# EasyEDA Pro project RCKid.epro, schematic Devboard, sheets 1 to 4 of 7

## Sheets
1 Power: Board Name: Devboard; Create Date: 2025-03-12; Page Name: Power; Project Name: rckid; Schematic Name: Devboard; Update Date: 2025-04-01; Company: EasyEDA.com; Drawed: EasyEDAPro; Page Size: A4; Part Number: JLCPCB-002; Reviewed: EasyEDAPro; Version: V0.1
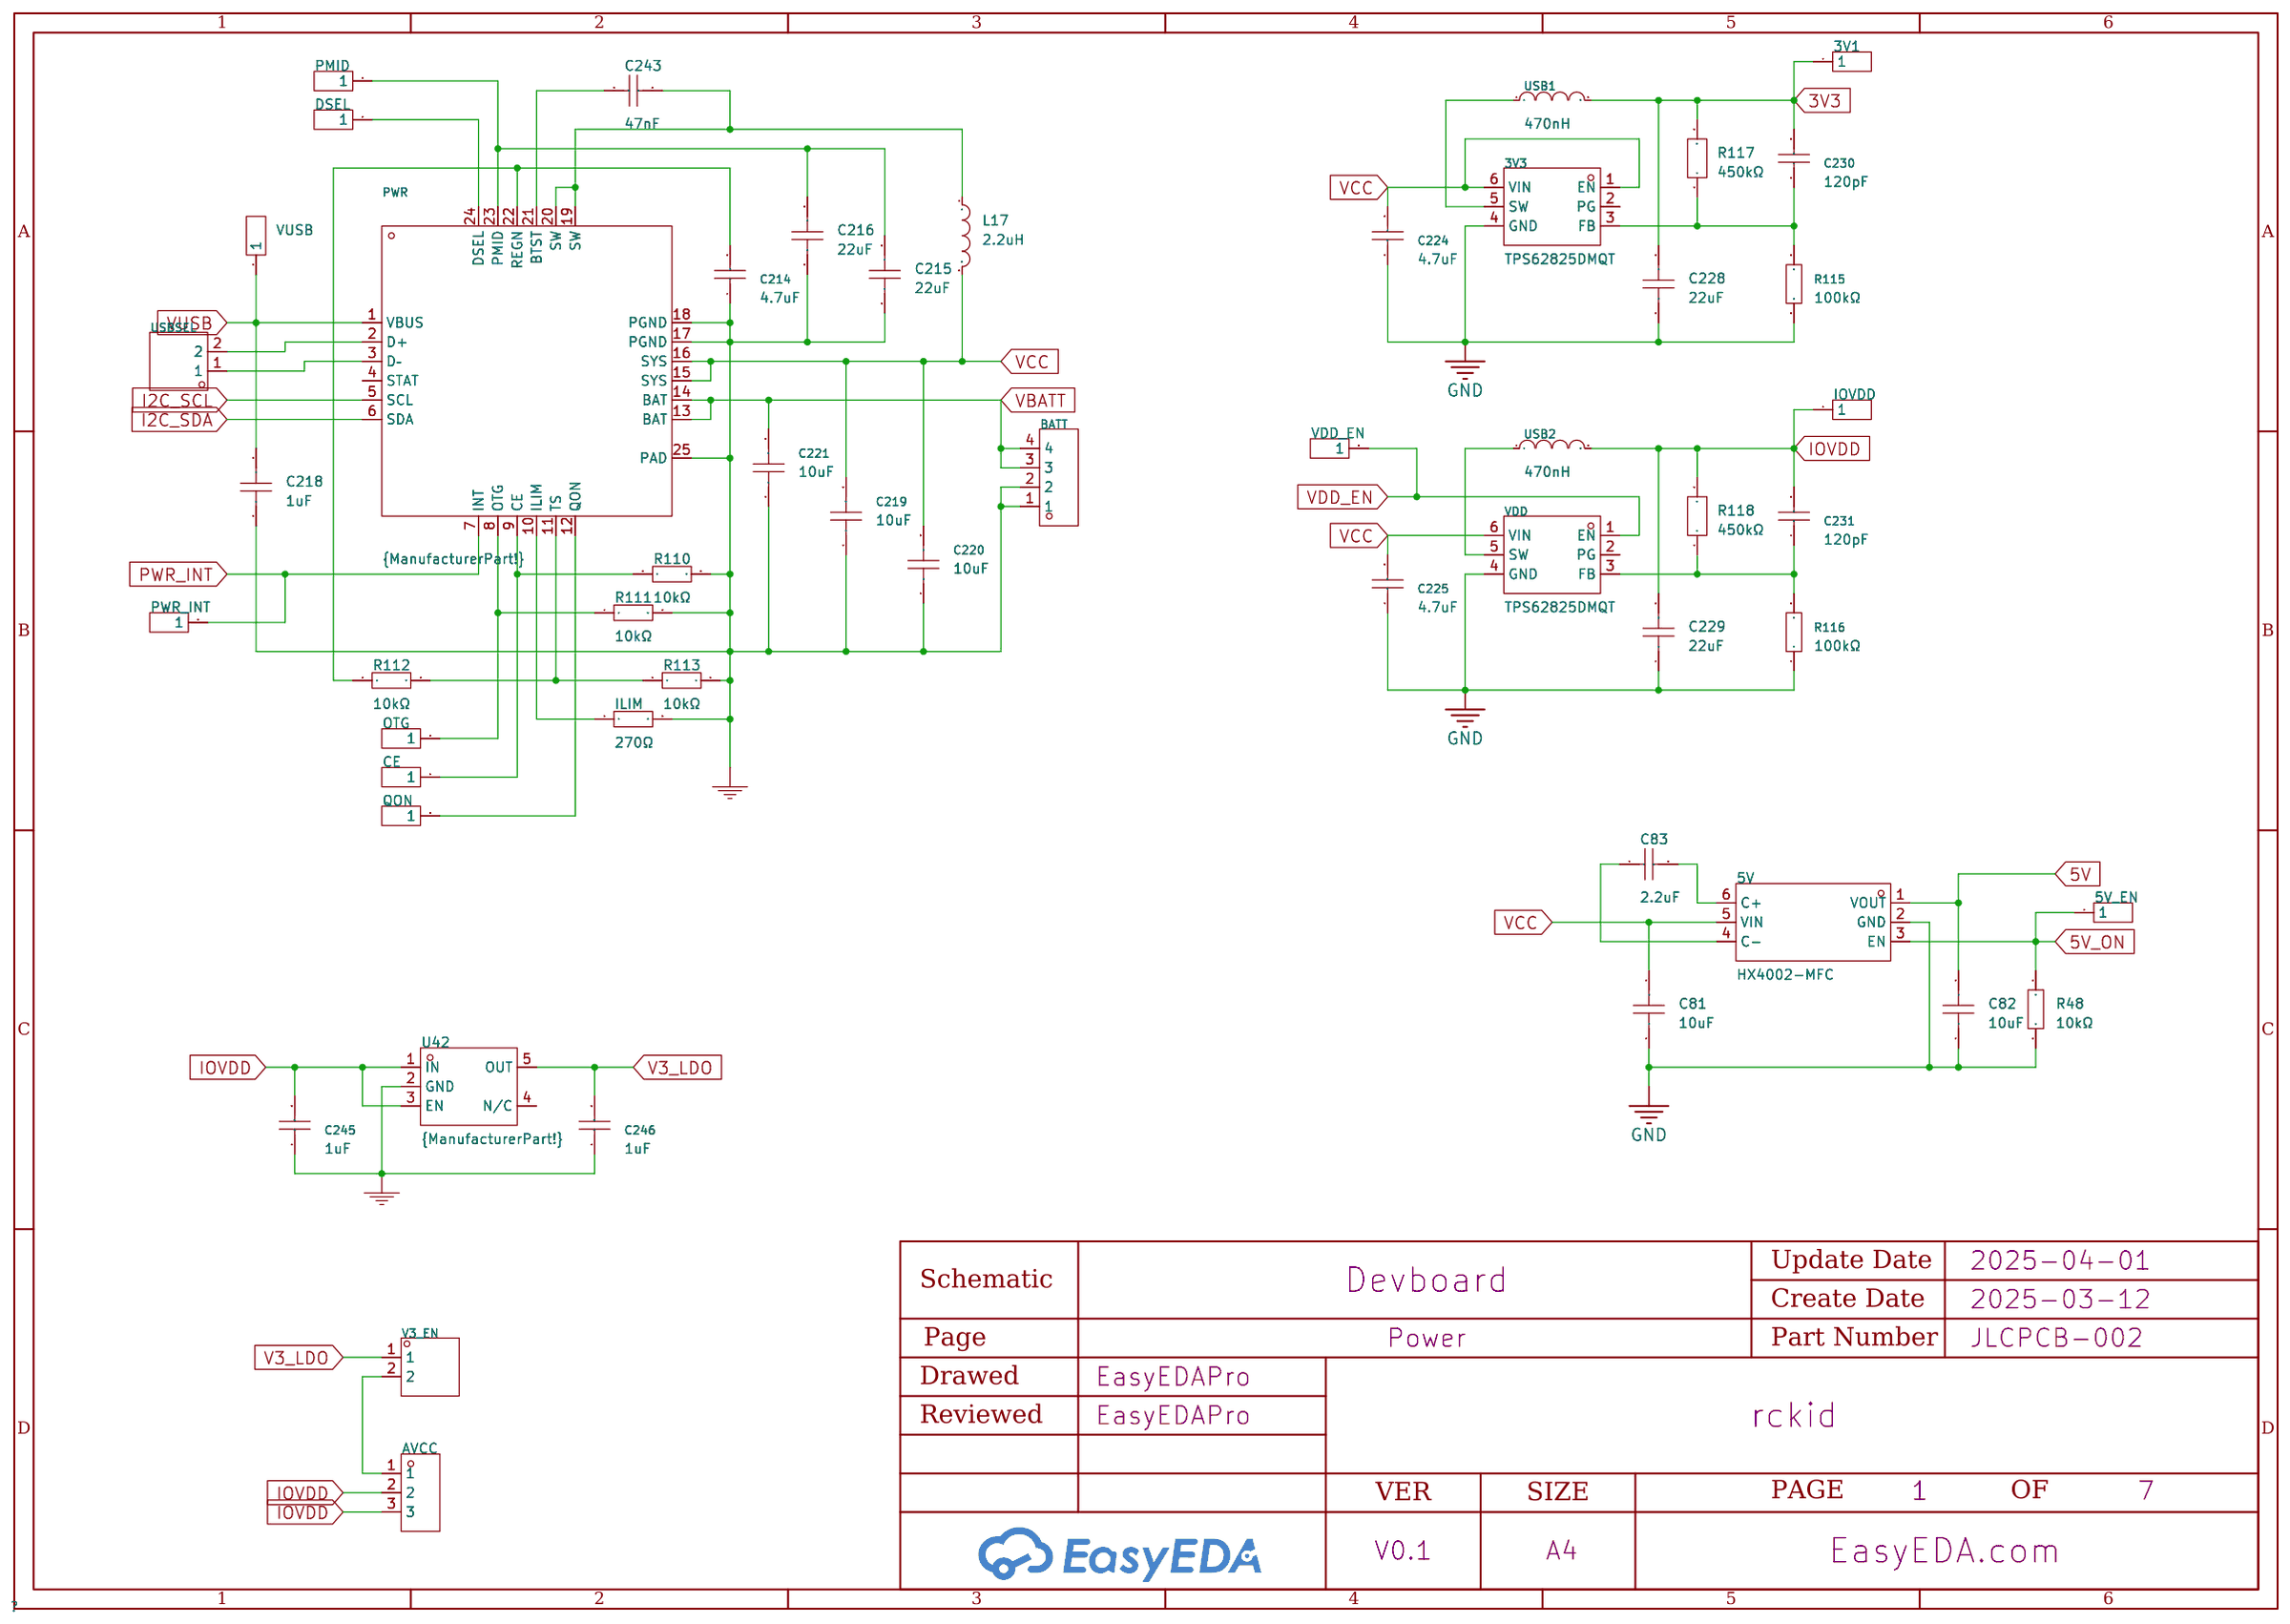
[diagram p2: Power]
2 Logic: Create Date: 2025-02-21; Page Name: Logic; Project Name: rckid3_devboard; Update Date: 2025-03-10
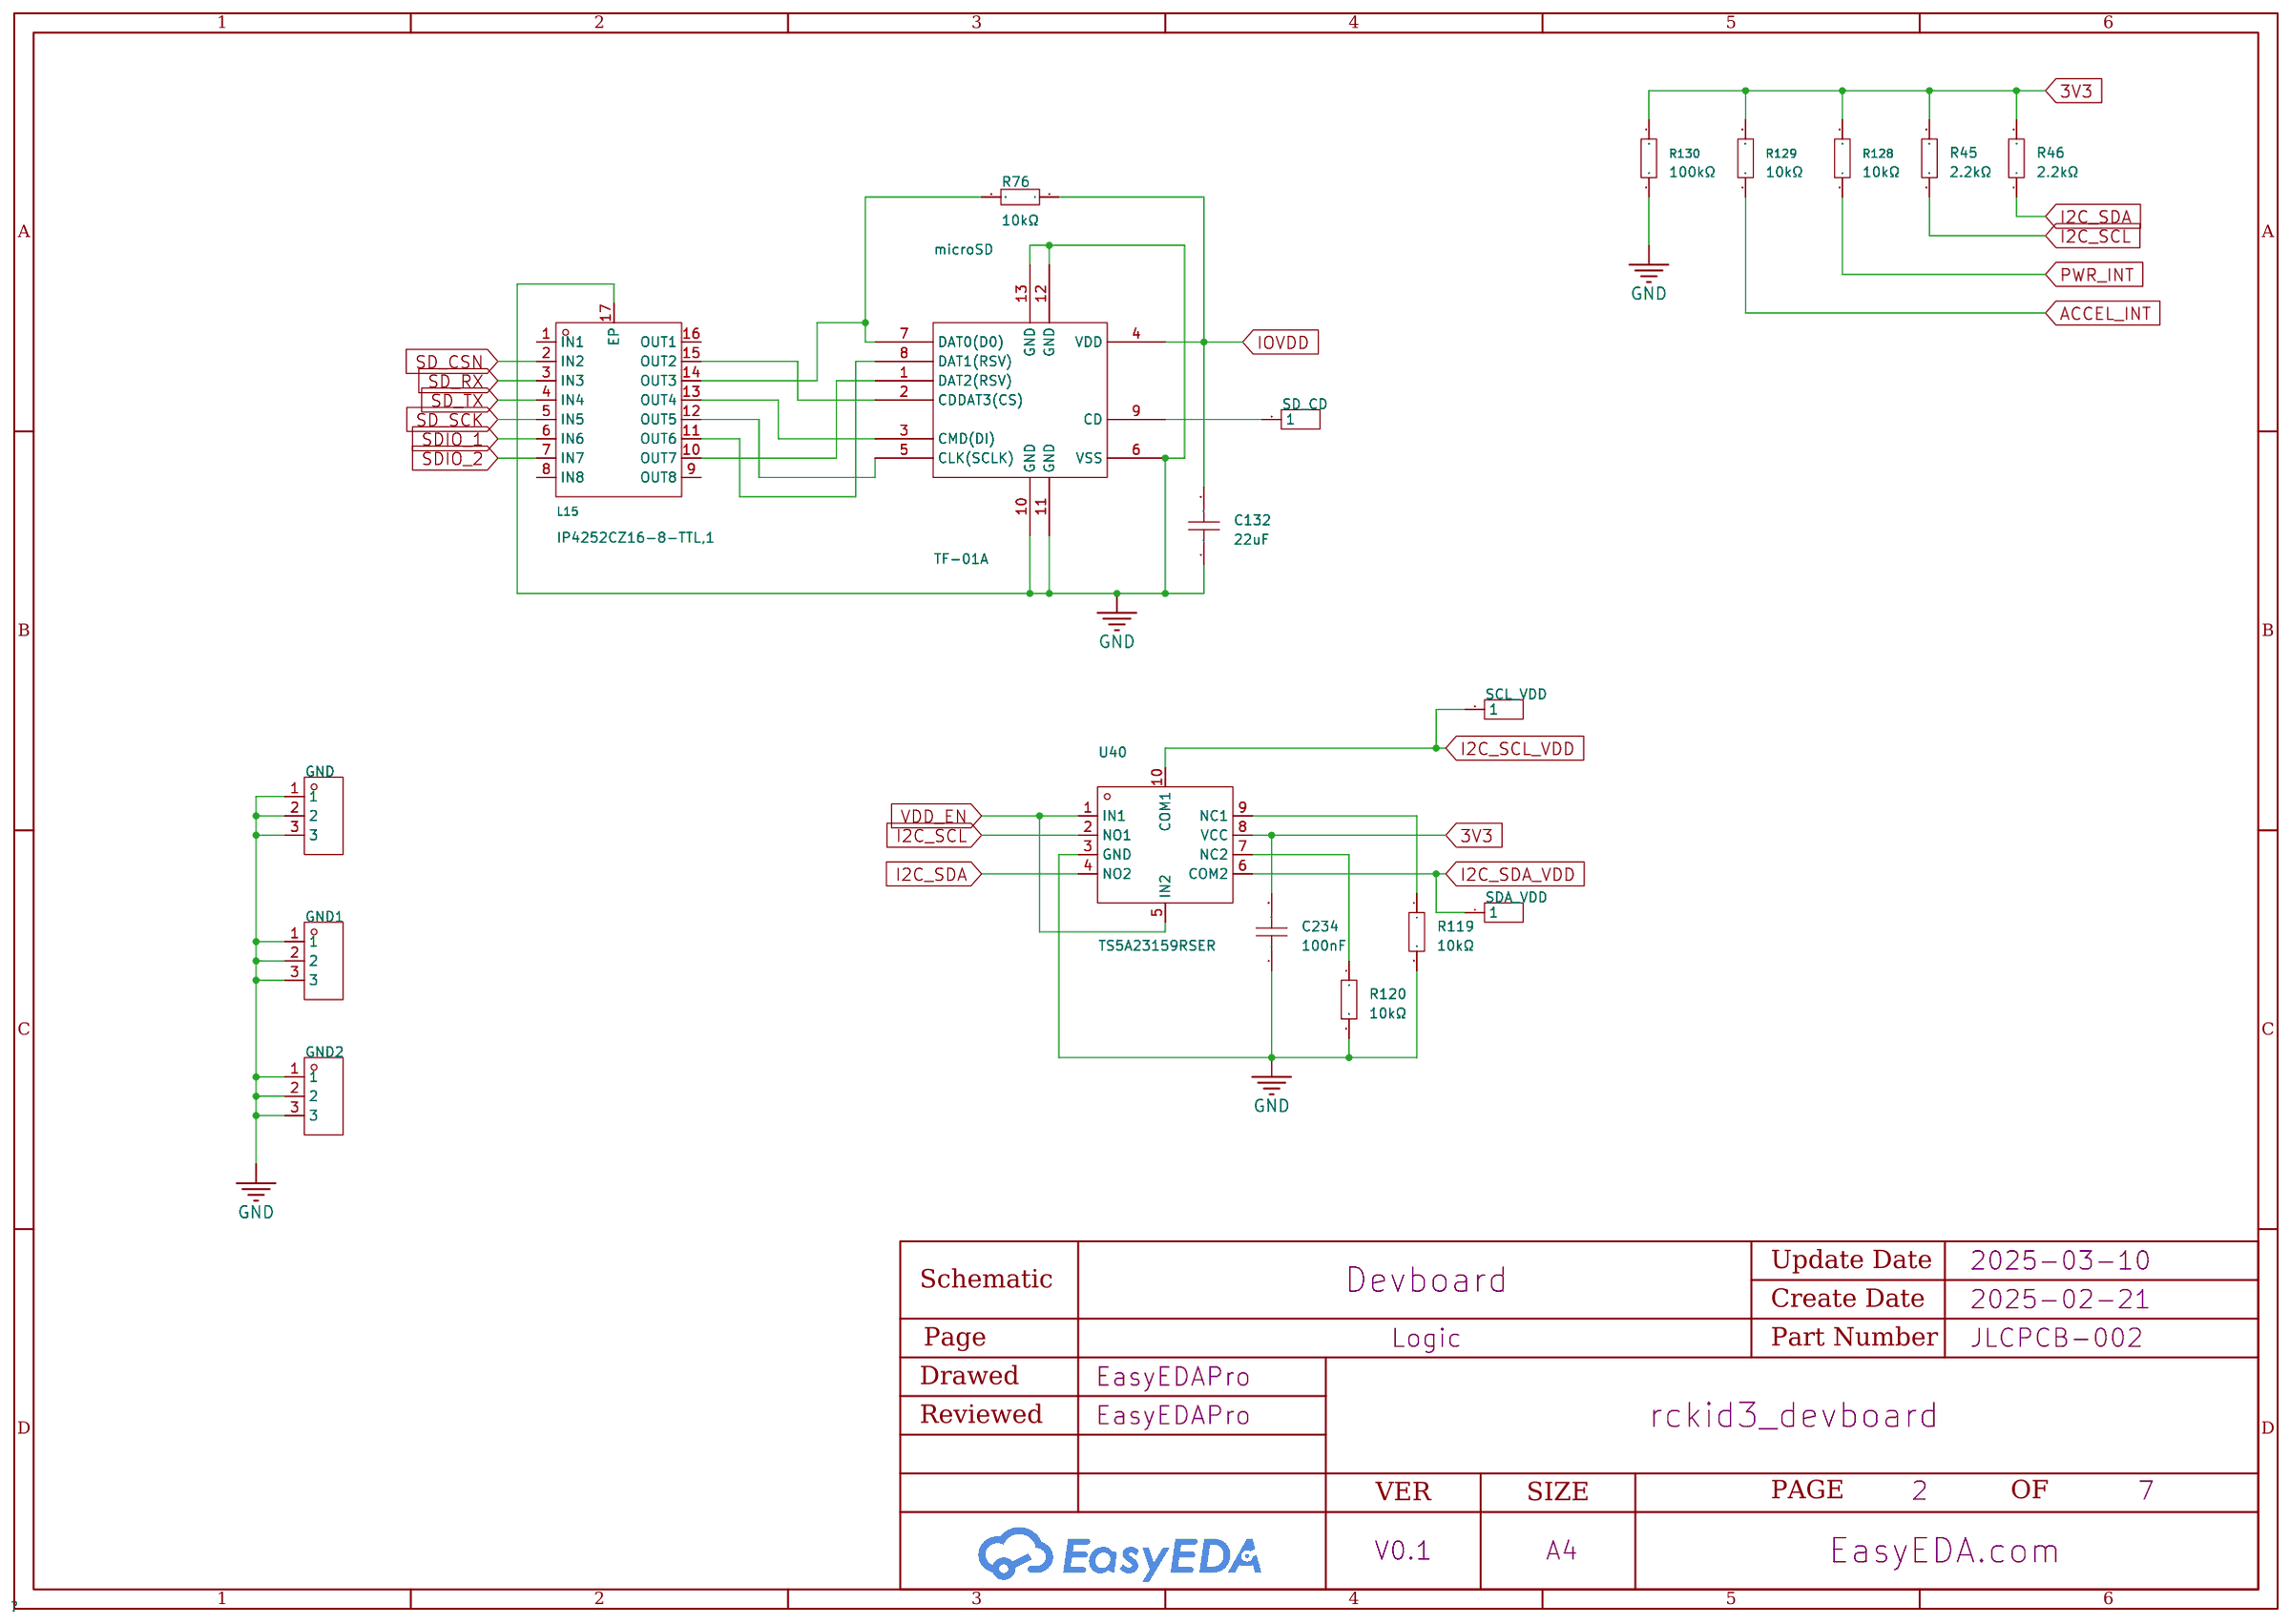
[diagram p3: Logic]
3 Audio: Page Name: Audio; Update Date: 2025-04-02
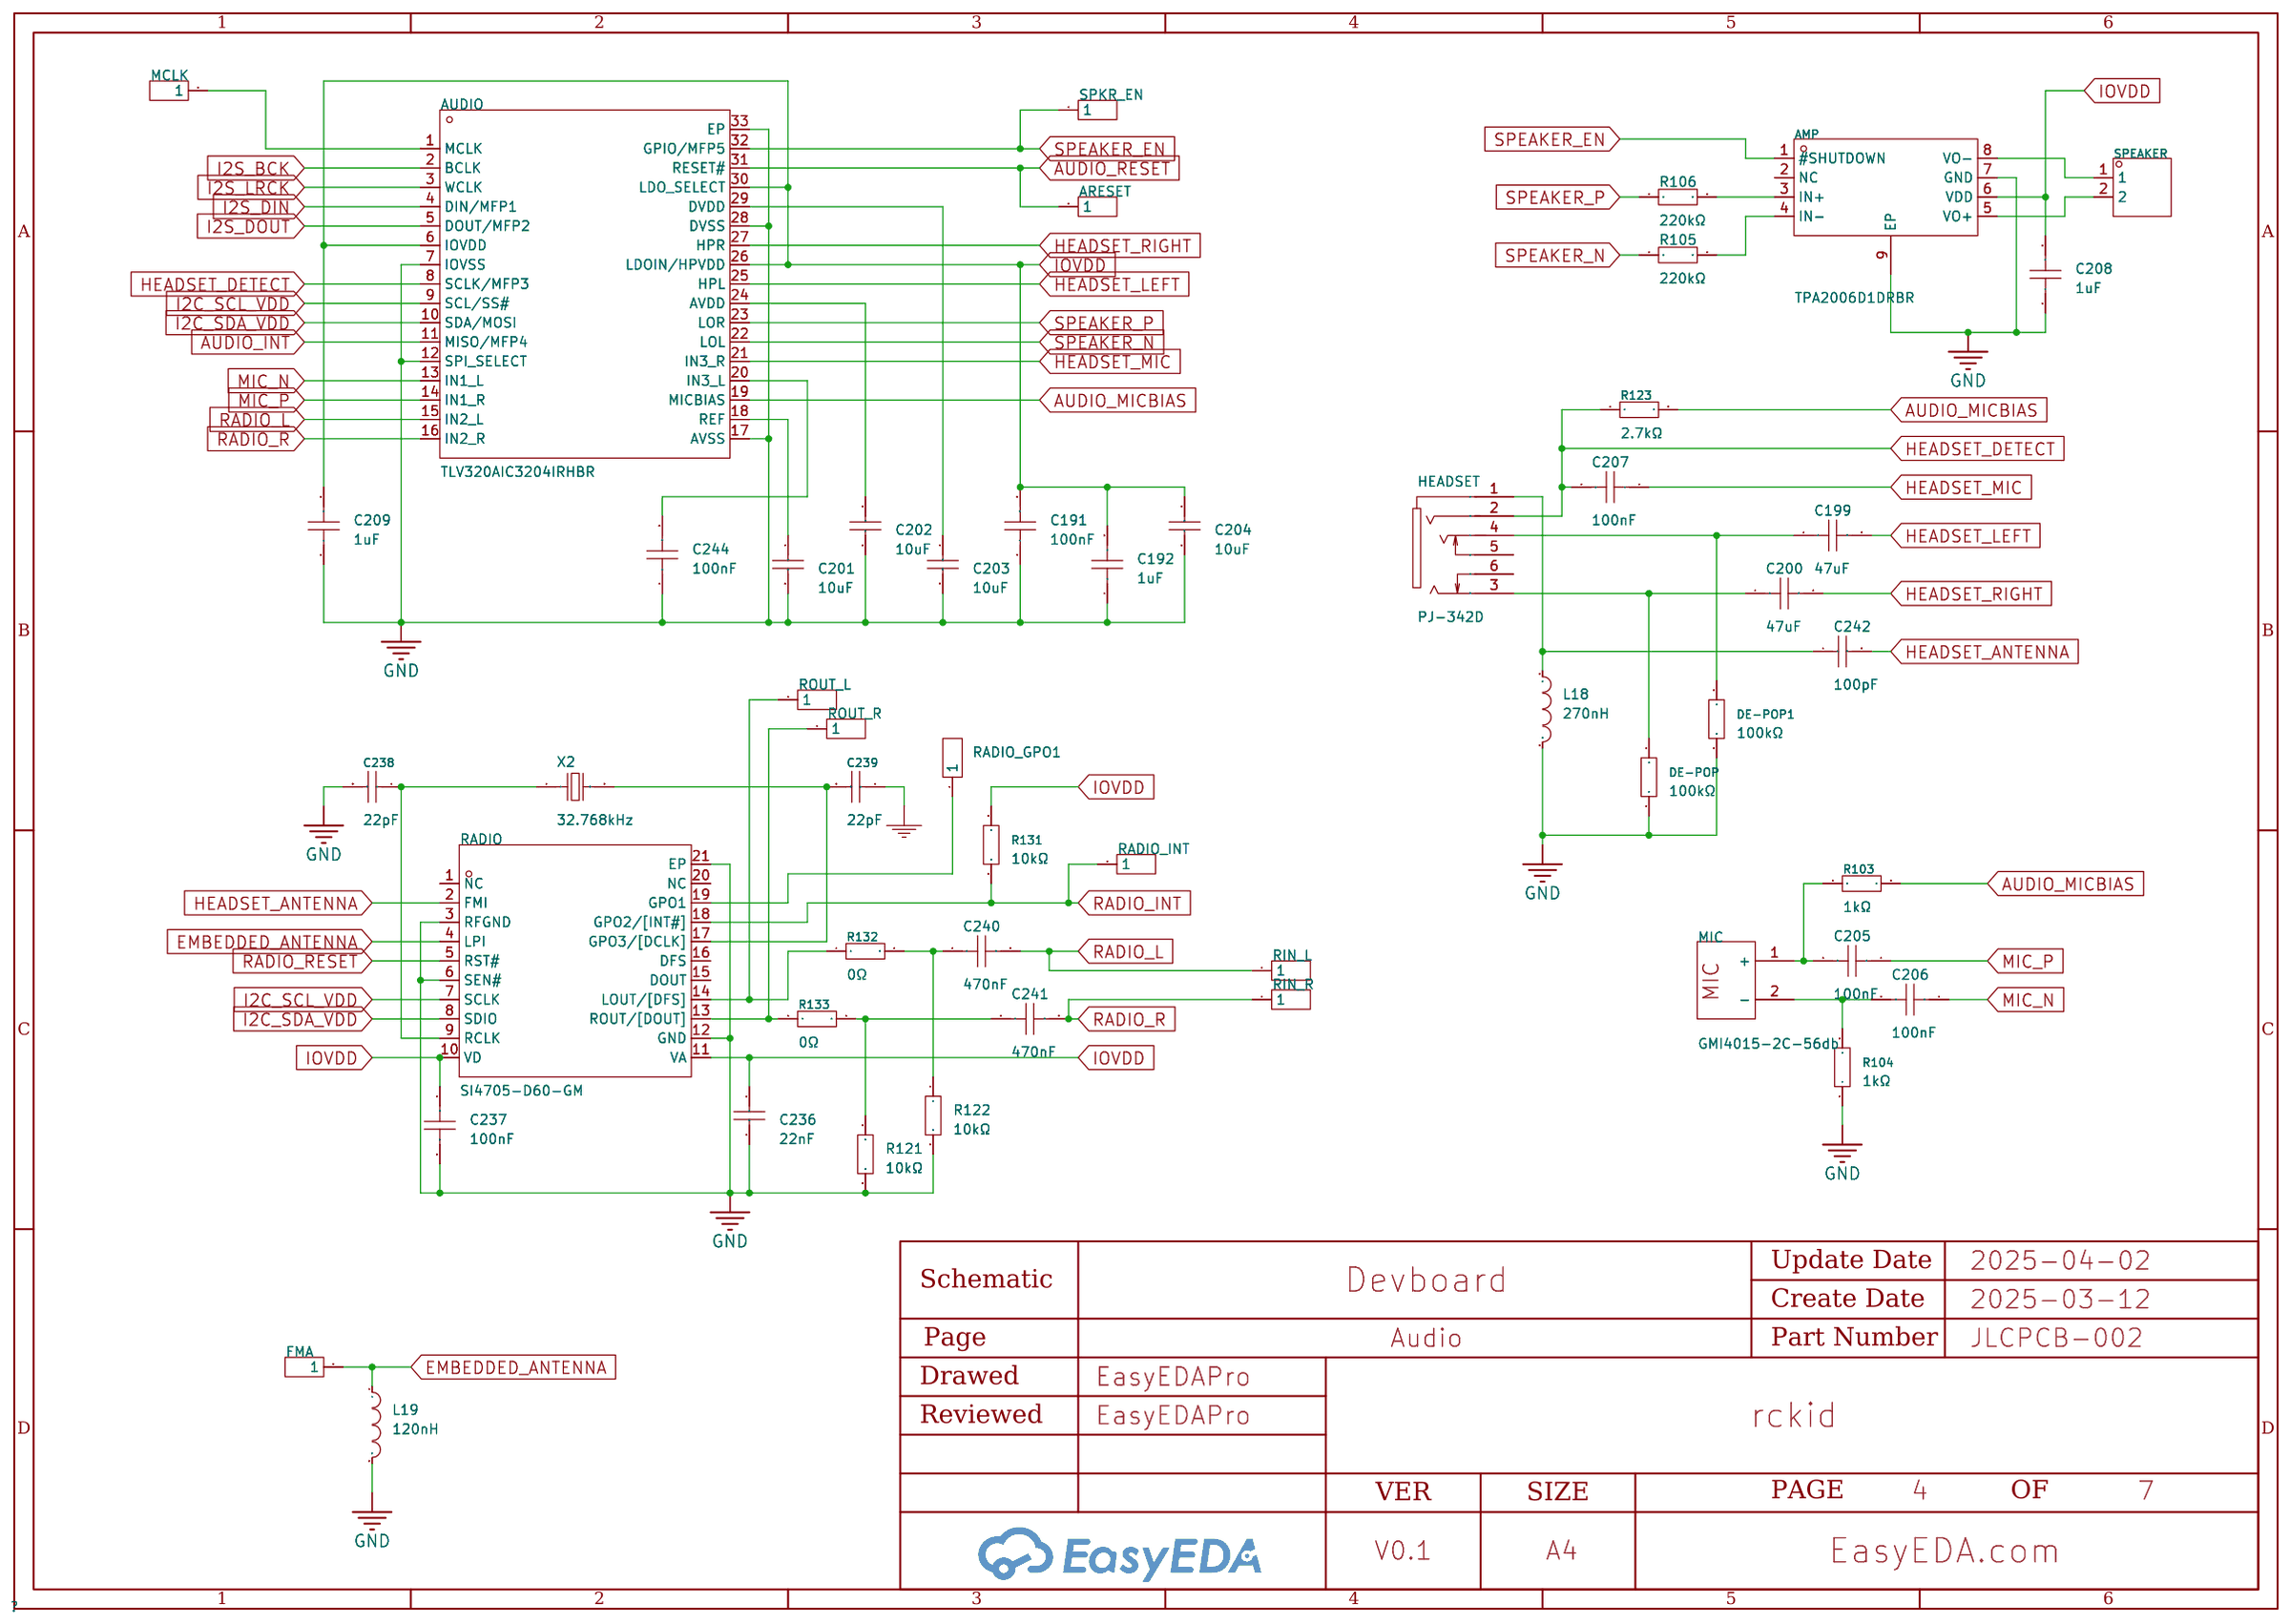
[diagram p4: Audio]
4 IO: Create Date: 2025-02-21; Page Name: IO; Project Name: rckid3_devboard; Update Date: 2025-03-10
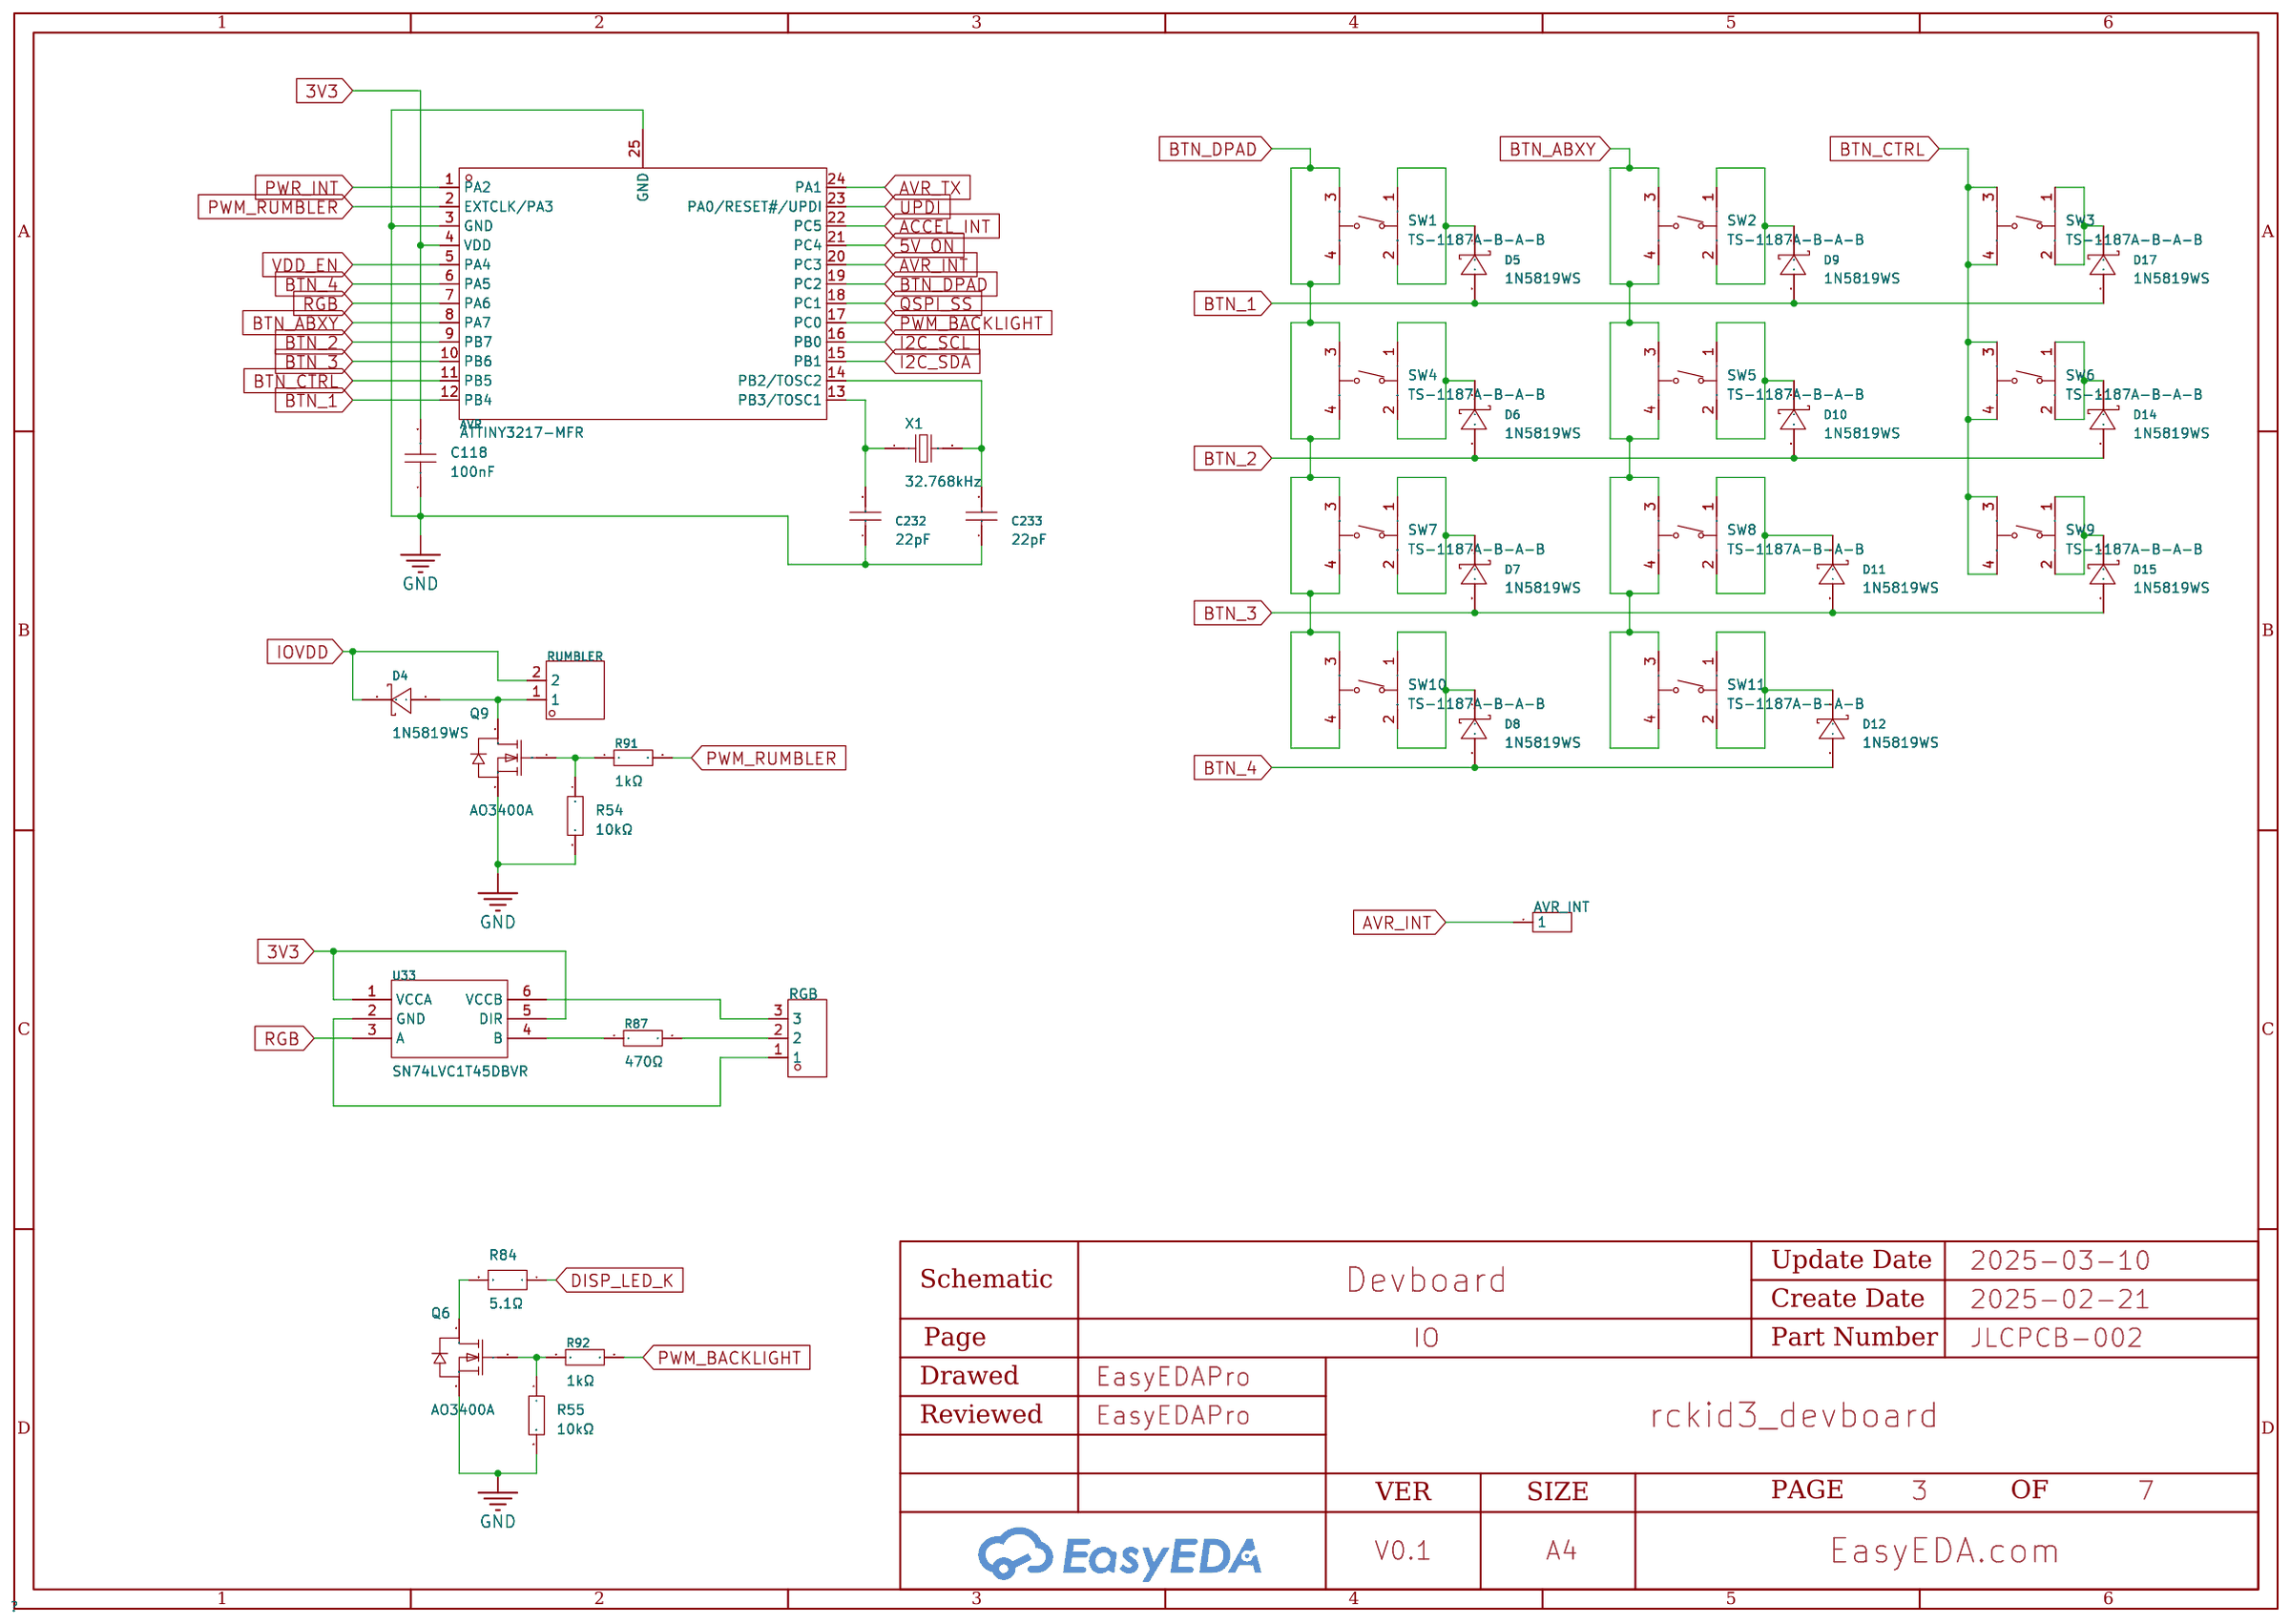
[diagram p5: IO]

## Parts
sheet Audio
AMP  TPA2006D1DRBR  [VSON-8_L3.0-W3.0-P0.65-TL-EP]
ARESET  -  [HDR-TH_1P-V-M_XKB_X4611WV-01I-C28D40]
AUDIO  TLV320AIC3204IRHBR  [QFN-32_L5.0-W5.0-P0.50-TL-EP3.4]
C191  100nF  [C0402]
C192  1uF  [C0402]
C199  47uF  [C1206]
C200  47uF  [C1206]
C201  10uF  [C0402]
C202  10uF  [C0402]
C203  10uF  [C0402]
C204  10uF  [C0402]
C205  100nF  [C0402]
C206  100nF  [C0402]
C207  100nF  [C0402]
C208  1uF  [C0402]
C209  1uF  [C0402]
C236  22nF  [C0402]
C237  100nF  [C0402]
C238  22pF  [C0805]
C239  22pF  [C0805]
C240  470nF  [C0805]
C241  470nF  [C0805]
C242  100pF  [C0402]
C244  100nF  [C0402]
DE-POP  100kΩ  [R0805]  (no BOM)
DE-POP1  100kΩ  [R0805]  (no BOM)
FMA  -  [HDR-TH_1P-V-M_XKB_X4611WV-01I-C28D40]
HEADSET  PJ-342D  [AUDIO-SMD_PJ-342D]
L18  270nH  [L0805]
L19  120nH  [L0805]
MCLK  -  [HDR-TH_1P-V-M_XKB_X4611WV-01I-C28D40]
MIC  GMI4015-2C-56db  [MIC-SMD_BD4.0_GMI4015-2C-32DB]
R103  1kΩ  [R0805]
R104  1kΩ  [R0805]
R105  220kΩ  [R0805]
R106  220kΩ  [R0805]
R121  10kΩ  [R0805]
R122  10kΩ  [R0805]
R123  2.7kΩ  [R0805]
R131  10kΩ  [R0805]  (no BOM)
R132  0Ω  [R0805]
R133  0Ω  [R0805]
RADIO  SI4705-D60-GM  [QFN-20_L3.0-W3.0-P0.50-TL-EP1.7_SILICON-LABS_SI47XX]
RADIO_GPO1  -  [HDR-TH_1P-V-M_XKB_X4611WV-01I-C28D40]
RADIO_INT  -  [HDR-TH_1P-V-M_XKB_X4611WV-01I-C28D40]
RIN_L  -  [HDR-TH_1P-V-M_XKB_X4611WV-01I-C28D40]
RIN_R  -  [HDR-TH_1P-V-M_XKB_X4611WV-01I-C28D40]
ROUT_L  -  [HDR-TH_1P-V-M_XKB_X4611WV-01I-C28D40]
ROUT_R  -  [HDR-TH_1P-V-M_XKB_X4611WV-01I-C28D40]
SPEAKER  -  [HDR-TH_2P-P2.54-V-M-1]
SPKR_EN  -  [HDR-TH_1P-V-M_XKB_X4611WV-01I-C28D40]
X2  32.768kHz  [FC-135R_L3.2-W1.5]
sheet IO
AVR  ATTINY3217-MFR  [WQFN-24_L4.0-W4.0-P0.50-TL-EP2.6]
AVR_INT  -  [HDR-TH_1P-V-M_XKB_X4611WV-01I-C28D40]
C118  100nF  [C0402]
C232  22pF  [C0805]
C233  22pF  [C0805]
D4  1N5819WS  [SOD-323_L1.8-W1.3-LS2.5-RD]
D5  1N5819WS  [SOD-323_L1.8-W1.3-LS2.5-RD]
D6  1N5819WS  [SOD-323_L1.8-W1.3-LS2.5-RD]
D7  1N5819WS  [SOD-323_L1.8-W1.3-LS2.5-RD]
D8  1N5819WS  [SOD-323_L1.8-W1.3-LS2.5-RD]
D9  1N5819WS  [SOD-323_L1.8-W1.3-LS2.5-RD]
D10  1N5819WS  [SOD-323_L1.8-W1.3-LS2.5-RD]
D11  1N5819WS  [SOD-323_L1.8-W1.3-LS2.5-RD]
D12  1N5819WS  [SOD-323_L1.8-W1.3-LS2.5-RD]
D14  1N5819WS  [SOD-323_L1.8-W1.3-LS2.5-RD]
D15  1N5819WS  [SOD-323_L1.8-W1.3-LS2.5-RD]
D17  1N5819WS  [SOD-323_L1.8-W1.3-LS2.5-RD]
Q6  AO3400A  [SOT-23-3_L2.9-W1.6-P1.90-LS2.8-BR]
Q9  AO3400A  [SOT-23-3_L2.9-W1.6-P1.90-LS2.8-BR]
R54  10kΩ  [R0402]
R55  10kΩ  [R0402]
R84  5.1Ω  [R0805]
R87  470Ω  [R0402]
R91  1kΩ  [R0402]
R92  1kΩ  [R0402]
RGB  -  [HDR-TH_3P-P2.54-V-M]
RUMBLER  -  [SMT wire pad (2)]
SW1  TS-1187A-B-A-B  [SW-SMD_4P-L5.1-W5.1-P3.70-LS6.5-TL_H1.5]
SW2  TS-1187A-B-A-B  [SW-SMD_4P-L5.1-W5.1-P3.70-LS6.5-TL_H1.5]
SW3  TS-1187A-B-A-B  [SW-SMD_4P-L5.1-W5.1-P3.70-LS6.5-TL_H1.5]
SW4  TS-1187A-B-A-B  [SW-SMD_4P-L5.1-W5.1-P3.70-LS6.5-TL_H1.5]
SW5  TS-1187A-B-A-B  [SW-SMD_4P-L5.1-W5.1-P3.70-LS6.5-TL_H1.5]
SW6  TS-1187A-B-A-B  [SW-SMD_4P-L5.1-W5.1-P3.70-LS6.5-TL_H1.5]
SW7  TS-1187A-B-A-B  [SW-SMD_4P-L5.1-W5.1-P3.70-LS6.5-TL_H1.5]
SW8  TS-1187A-B-A-B  [SW-SMD_4P-L5.1-W5.1-P3.70-LS6.5-TL_H1.5]
SW9  TS-1187A-B-A-B  [SW-SMD_4P-L5.1-W5.1-P3.70-LS6.5-TL_H1.5]
SW10  TS-1187A-B-A-B  [SW-SMD_4P-L5.1-W5.1-P3.70-LS6.5-TL_H1.5]
SW11  TS-1187A-B-A-B  [SW-SMD_4P-L5.1-W5.1-P3.70-LS6.5-TL_H1.5]
U33  SN74LVC1T45DBVR  [SOT-23-6_L2.9-W1.6-P0.95-LS2.8-BR]
X1  32.768kHz  [FC-135R_L3.2-W1.5]
sheet Logic
C132  22uF  [C0603]
C234  100nF  [C0402]
GND  -  [HDR-TH_3P-P2.54-V-M]
GND1  -  [HDR-TH_3P-P2.54-V-M]
GND2  -  [HDR-TH_3P-P2.54-V-M]
L15  IP4252CZ16-8-TTL,1  [UDFN-16_L3.3-W1.4-P0.40-BL-EP]
microSD  TF-01A  [TF-SMD_TF-01A]
R45  2.2kΩ  [R0805]
R46  2.2kΩ  [R0805]
R76  10kΩ  [R0402]
R119  10kΩ  [R0402]
R120  10kΩ  [R0402]
R128  10kΩ  [R0805]  (no BOM)
R129  10kΩ  [R0805]  (no BOM)
R130  100kΩ  [R0805]  (no BOM)
SCL_VDD  -  [HDR-TH_1P-V-M_XKB_X4611WV-01I-C28D40]
SD_CD  -  [HDR-TH_1P-V-M_XKB_X4611WV-01I-C28D40]
SDA_VDD  -  [HDR-TH_1P-V-M_XKB_X4611WV-01I-C28D40]
U40  TS5A23159RSER  [UQFN-10_L2.0-W1.5-P0.50-BL-EP]
sheet Power
3V1  -  [HDR-TH_1P-V-M_XKB_X4611WV-01I-C28D40]
3V3  TPS62825DMQT  [VSON-6_L1.5-W1.5-P0.50-TL]
5V  HX4002-MFC  [SOT-23-6_L2.9-W1.6-P0.95-LS2.8-BR]
5V_EN  -  [HDR-TH_1P-V-M_XKB_X4611WV-01I-C28D40]
AVCC  -  [HDR-TH_3P-P2.54-V-M]
BATT  -  [HDR-TH_4P-P2.54-V-M]
C81  10uF  [C0603]
C82  10uF  [C0603]
C83  2.2uF  [C0603]
C214  4.7uF  [C0402]
C215  22uF  [C0603]
C216  22uF  [C0603]
C218  1uF  [C0402]
C219  10uF  [C0603]
C220  10uF  [C0603]
C221  10uF  [C0603]
C224  4.7uF  [C0402]
C225  4.7uF  [C0402]
C228  22uF  [C0603]
C229  22uF  [C0603]
C230  120pF  [C0402]
C231  120pF  [C0402]
C243  47nF  [C0603]
C245  1uF  [C0805]
C246  1uF  [C0805]
CE  -  [HDR-TH_1P-V-M_XKB_X4611WV-01I-C28D40]
DSEL  -  [HDR-TH_1P-V-M_XKB_X4611WV-01I-C28D40]
ILIM  270Ω  [R0805]
IOVDD  -  [HDR-TH_1P-V-M_XKB_X4611WV-01I-C28D40]
L17  2.2uH  [IND-SMD_L3.0-W3.0_IHLP-1212BZ]
OTG  -  [HDR-TH_1P-V-M_XKB_X4611WV-01I-C28D40]
PMID  -  [HDR-TH_1P-V-M_XKB_X4611WV-01I-C28D40]
PWR  -  [QFN-24_L4.0-W4.0-P0.50-TL-EP2.7]
PWR_INT  -  [HDR-TH_1P-V-M_XKB_X4611WV-01I-C28D40]
QON  -  [HDR-TH_1P-V-M_XKB_X4611WV-01I-C28D40]
R48  10kΩ  [R0402]
R110  10kΩ  [R0402]
R111  10kΩ  [R0402]
R112  10kΩ  [R0402]
R113  10kΩ  [R0402]
R115  100kΩ  [R0402]
R116  100kΩ  [R0402]
R117  450kΩ  [R0402]
R118  450kΩ  [R0402]
U42  -  [TSOT-23-5_L2.9-W1.6-P0.95-LS2.8-BR]
USB1  470nH  [IND-SMD_L2.0-W1.6]
USB2  470nH  [IND-SMD_L2.0-W1.6]
USBSEL  -  [HDR-TH_2P-P2.54-V-M-1]
V3_EN  -  [HDR-TH_2P-P2.54-V-M-1]
VDD  TPS62825DMQT  [VSON-6_L1.5-W1.5-P0.50-TL]
VDD_EN  -  [HDR-TH_1P-V-M_XKB_X4611WV-01I-C28D40]
VUSB  -  [HDR-TH_1P-V-M_XKB_X4611WV-01I-C28D40]

## Library data of the parts
AMP = TPA2006D1DRBR: Type of Power Amplifier: Output Power:; LCSC Part Name: 2.5W单声道D类音频功率放大器; Supplier Part: C524793; Manufacturer: TI(德州仪器); Supplier Footprint: VSON-8-EP(3x3); JLCPCB Part Class: Extended Part; Datasheet: https://www.ti.com/cn/lit/gpn/tpa2006d1; Supplier: LCSC
3V1 5V_EN ARESET AVR_INT CE DSEL FMA IOVDD MCLK OTG PMID PWR_INT QON RADIO_GPO1 RADIO_INT RIN_L RIN_R ROUT_L ROUT_R SCL_VDD SD_CD SDA_VDD SPKR_EN VDD_EN VUSB = HDR-M_2.54_1x1P: Supplier Footprint: Through
AUDIO = TLV320AIC3204IRHBR: Type:Codec Interface:I2C；SPI Sampling Frequency:- Sampling Frequency:- Supply Voltage:- Supply Voltage:- Operating Temperature:-40℃~+85℃ Operating Temperature:-40℃~+85℃; LCSC Part Name: 超低功耗立体声音频编解码器; Supplier Part: C24109; Manufacturer: TI(德州仪器); Supplier Footprint: QFN-32-EP(5x5); JLCPCB Part Class: Extended Part; Datasheet: https://www.ti.com/cn/lit/gpn/tlv320aic3204; Supplier: LCSC; Type: Codec; Interface: I2C；SPI; Operating Temperature: -40℃~+85℃
C118 C191 C205-C207 C234 C237 C244 = CL05B104KB54PNC: Capacitance: Tolerance:±10% Tolerance:±10% Voltage Rated: Temperature Coefficient:; LCSC Part Name: 100nF ±10% 50V; Supplier Part: C307331; Manufacturer: SAMSUNG(三星); Supplier Footprint: 0402; JLCPCB Part Class: Basic Part; Datasheet: https://atta.szlcsc.com/upload/public/pdf/source/20181009/C307331_222F7C870FD3EA5F46F538B483443886.pdf; Supplier: LCSC; Tolerance: ±10%
C192 C208 C209 C218 = CL05A105KA5NQNC: Capacitance: Tolerance:±10% Tolerance:±10% Voltage Rated: Temperature Coefficient:; LCSC Part Name: 1uF±10%25V; Supplier Part: C52923; Manufacturer: SAMSUNG(三星); Supplier Footprint: 0402; JLCPCB Part Class: BasicPart; Datasheet: https://atta.szlcsc.com/upload/public/pdf/source/20160103/1457707735223.pdf; Supplier: LCSC; Tolerance: ±10%
C199 C200 = CL31A476MPHNNNE: Capacitance: Tolerance:±20% Tolerance:±20% Voltage Rated: Temperature Coefficient:; LCSC Part Name: 47uF ±20% 10V; Supplier Part: C96123; Manufacturer: SAMSUNG(三星); Supplier Footprint: 1206; JLCPCB Part Class: Basic Part; Datasheet: https://atta.szlcsc.com/upload/public/pdf/source/20160218/1457707763339.pdf; Supplier: LCSC; Tolerance: ±20%
C201-C204 = CL05A106MQ5NUNC: Capacitance: Tolerance:±20% Tolerance:±20% Voltage Rated: Temperature Coefficient:; LCSC Part Name: 10uF±20%6.3V; Supplier Part: C15525; Manufacturer: SAMSUNG(三星); Supplier Footprint: 0402; JLCPCB Part Class: BasicPart; Datasheet: https://atta.szlcsc.com/upload/public/pdf/source/20220823/2B02EE04F8F211D38A52DCB16EB6BEBA.pdf; Supplier: LCSC; Tolerance: ±20%
C236 = 0402B223K500NT: Capacitance:22nF Tolerance:±10% Tolerance:±10% Voltage Rated: Temperature Coefficient:; LCSC Part Name: 22nF ±10% 50V; Supplier Part: C1532; Manufacturer: FH(风华); Supplier Footprint: 0402; JLCPCB Part Class: Basic Part; Datasheet: https://atta.szlcsc.com/upload/public/pdf/source/20200305/C486355_26A10D38EF8C2A5C37091D0039909270.pdf; Supplier: LCSC; Tolerance: ±10%
C232 C233 C238 C239 = CL21C220JBANNNC: Capacitance: Tolerance:±5% Tolerance:±5% Voltage Rated: Temperature Coefficient:; LCSC Part Name: 22pF ±5% 50V; Supplier Part: C1804; Manufacturer: SAMSUNG(三星); Supplier Footprint: 0805; JLCPCB Part Class: Basic Part; Datasheet: https://atta.szlcsc.com/upload/public/pdf/source/20160218/1457707763339.pdf; Supplier: LCSC; Tolerance: ±5%
C240 C241 = CL21B474KBFNNNE: Capacitance: Tolerance:±10% Tolerance:±10% Voltage Rated: Temperature Coefficient:; LCSC Part Name: 470nF ±10% 50V; Supplier Part: C13967; Manufacturer: SAMSUNG(三星); Supplier Footprint: 0805; JLCPCB Part Class: Basic Part; Datasheet: https://atta.szlcsc.com/upload/public/pdf/source/20160218/1457707763339.pdf; Supplier: LCSC; Tolerance: ±10%
C242 = 0402CG101J500NT: Capacitance: Tolerance:±5% Tolerance:±5% Voltage Rated: Temperature Coefficient:; LCSC Part Name: 100pF ±5% 50V; Supplier Part: C1546; Manufacturer: FH(风华); Supplier Footprint: 0402; JLCPCB Part Class: Basic Part; Datasheet: https://atta.szlcsc.com/upload/public/pdf/source/20200305/C486355_26A10D38EF8C2A5C37091D0039909270.pdf; Supplier: LCSC; Tolerance: ±5%
DE-POP DE-POP1 R130 = 0805W8F1003T5E: Type:Thick Film Resistors Resistance:100kΩ Tolerance:±1% Tolerance:±1% Power(Watts): Overload Voltage (Max): Temperature Coefficient:±100ppm/℃ Temperature Coefficient:±100ppm/℃ Operating Temperature Range:-55℃~+155℃ Operating Temperature Range:-55℃~+155℃; LCSC Part Name: 100kΩ ±1% 125mW 厚膜电阻; Supplier Part: C149504; Manufacturer: UNI-ROYAL(厚声); Supplier Footprint: 0805; JLCPCB Part Class: Basic Part; Datasheet: https://atta.szlcsc.com/upload/public/pdf/source/20200306/C422600_1E6D84923E4A46A82E41ADD87F860B5C.pdf; Supplier: LCSC; Type: Thick Film Resistors; Tolerance: ±1%; Temperature Coefficient: ±100ppm/℃; Operating Temperature Range: -55℃~+155℃
HEADSET = PJ-342D: Connector Type:3.5mm耳机座 Current Rating (Max):500mA Voltage Rating (Max):30V Operating Temperature Range:-20℃~+70℃ Operating Temperature Range:-20℃~+70℃ Soldering Temperature(Max):235℃; LCSC Part Name: 3.5mm耳机座; Supplier Part: C2689707; Manufacturer: XKB Connectivity(中国星坤); Supplier Footprint: SMD; JLCPCB Part Class: Extended Part; Datasheet: https://atta.szlcsc.com/upload/public/pdf/source/20211011/5410BBAF7F4CEA04F8E2A1AE1B358EC2.pdf; Supplier: LCSC; Connector Type: 3.5mm耳机座; Current Rating (Max): 500mA; Voltage Rating (Max): 30V; Operating Temperature Range: -20℃~+70℃; Soldering Temperature(Max): 235℃
L18 = VHF201209HR27JT: Inductance:270nH Tolerance:±5% Tolerance:±5% Rated Current: Saturation Current (Isat):- DC Resistance (DCR): Q @ Freq:- Frequency - Self Resonant:- Ratings:; LCSC Part Name: 270nH ±5%; Supplier Part: C395103; Manufacturer: FH(风华); Supplier Footprint: 0805; JLCPCB Part Class: Extended Part; Datasheet: https://atta.szlcsc.com/upload/public/pdf/source/20230223/DB206AC541C71FBD79E291598E86C2F5.pdf; Supplier: LCSC; Tolerance: ±5%
L19 = VHF201209HR12JT: Inductance:120nH Tolerance:±5% Tolerance:±5% Rated Current: Saturation Current (Isat):- DC Resistance (DCR): Q @ Freq:- Frequency - Self Resonant:- Ratings:; LCSC Part Name: 120nH ±5%; Supplier Part: C46435; Manufacturer: FH(风华); Supplier Footprint: 0805; JLCPCB Part Class: Extended Part; Datasheet: https://atta.szlcsc.com/upload/public/pdf/source/20230223/DB206AC541C71FBD79E291598E86C2F5.pdf; Supplier: LCSC; Tolerance: ±5%
MIC = GMI4015-2C-56db: LCSC Part Name: 全指向双电容φ4.0*1.5mm 1.5V-10V 灵敏度-56dB 低阻抗; Supplier Part: C233280; Manufacturer: INGHAi(赢海); JLCPCB Part Class: Extended Part; Datasheet: https://atta.szlcsc.com/upload/public/pdf/source/20180613/C233285_B82B48E7113DD15BB0DB65002027213C.pdf; Supplier: LCSC
R103 R104 = 0805W8F1001T5E: Type:Thick Film Resistors Resistance:1kΩ Tolerance:±1% Tolerance:±1% Power(Watts): Overload Voltage (Max): Temperature Coefficient:±100ppm/℃ Temperature Coefficient:±100ppm/℃ Operating Temperature Range:-55℃~+155℃ Operating Temperature Range:-55℃~+155℃; LCSC Part Name: 1kΩ ±1% 125mW 厚膜电阻; Supplier Part: C17513; Manufacturer: UNI-ROYAL(厚声); Supplier Footprint: 0805; JLCPCB Part Class: Basic Part; Datasheet: https://atta.szlcsc.com/upload/public/pdf/source/20200306/C422600_1E6D84923E4A46A82E41ADD87F860B5C.pdf; Supplier: LCSC; Type: Thick Film Resistors; Tolerance: ±1%; Temperature Coefficient: ±100ppm/℃; Operating Temperature Range: -55℃~+155℃
R105 R106 = 0805W8F2203T5E: Type:Thick Film Resistors Resistance:220kΩ Tolerance:±1% Tolerance:±1% Power(Watts): Overload Voltage (Max): Temperature Coefficient:±100ppm/℃ Temperature Coefficient:±100ppm/℃ Operating Temperature Range:-55℃~+155℃ Operating Temperature Range:-55℃~+155℃; LCSC Part Name: 220kΩ ±1% 125mW 厚膜电阻; Supplier Part: C17556; Manufacturer: UNI-ROYAL(厚声); Supplier Footprint: 0805; JLCPCB Part Class: Basic Part; Datasheet: https://atta.szlcsc.com/upload/public/pdf/source/20200306/C422600_1E6D84923E4A46A82E41ADD87F860B5C.pdf; Supplier: LCSC; Type: Thick Film Resistors; Tolerance: ±1%; Temperature Coefficient: ±100ppm/℃; Operating Temperature Range: -55℃~+155℃
R121 R122 = 0805W8F1002T5E: Type:Thick Film Resistors Resistance:10kΩ Tolerance:±1% Tolerance:±1% Power(Watts): Overload Voltage (Max): Temperature Coefficient:±100ppm/℃ Temperature Coefficient:±100ppm/℃ Operating Temperature Range:-55℃~+155℃ Operating Temperature Range:-55℃~+155℃; LCSC Part Name: 10kΩ ±1% 125mW 厚膜电阻; Supplier Part: C17414; Manufacturer: UNI-ROYAL(厚声); Supplier Footprint: 0805; JLCPCB Part Class: Basic Part; Datasheet: https://atta.szlcsc.com/upload/public/pdf/source/20200306/C422600_1E6D84923E4A46A82E41ADD87F860B5C.pdf; Supplier: LCSC; Tolerance: ±1%; Temperature Coefficient: ±100ppm/℃; Type: Thick Film Resistors; Operating Temperature Range: -55℃~+155℃
R123 = 0805W8F2701T5E: Type:Thick Film Resistors Resistance:2.7kΩ Tolerance:±1% Tolerance:±1% Power(Watts): Overload Voltage (Max): Temperature Coefficient:±100ppm/℃ Temperature Coefficient:±100ppm/℃ Operating Temperature Range:-55℃~+155℃ Operating Temperature Range:-55℃~+155℃; LCSC Part Name: 2.7kΩ ±1% 125mW 厚膜电阻; Supplier Part: C17530; Manufacturer: UNI-ROYAL(厚声); Supplier Footprint: 0805; JLCPCB Part Class: Basic Part; Datasheet: https://atta.szlcsc.com/upload/public/pdf/source/20200306/C422600_1E6D84923E4A46A82E41ADD87F860B5C.pdf; Supplier: LCSC; Type: Thick Film Resistors; Tolerance: ±1%; Temperature Coefficient: ±100ppm/℃; Operating Temperature Range: -55℃~+155℃
R128 R129 R131 = 0805W8F1002T5E: Resistance:10000Ω Tolerance:±1% Tolerance:±1% Power(Watts): Overload Voltage (Max): Temperature Coefficient:±100ppm/℃ Temperature Coefficient:±100ppm/℃ Type:Thick Film Resistors Operating Temperature Range:-55℃~+155℃ Operating Temperature Range:-55℃~+155℃; LCSC Part Name: 10kΩ ±1% 125mW 厚膜电阻; Supplier Part: C17414; Manufacturer: UNI-ROYAL(厚声); Supplier Footprint: 0805; JLCPCB Part Class: Basic Part; Datasheet: https://atta.szlcsc.com/upload/public/pdf/source/20200306/C422600_1E6D84923E4A46A82E41ADD87F860B5C.pdf; Supplier: LCSC; Tolerance: ±1%; Temperature Coefficient: ±100ppm/℃; Type: Thick Film Resistors; Operating Temperature Range: -55℃~+155℃
R132 R133 = 0805W8F0000T5E_C17477: Type:Thick Film Resistors Resistance: Tolerance:±1% Tolerance:±1% Power(Watts): Overload Voltage (Max): Temperature Coefficient:±800ppm/℃ Temperature Coefficient:±800ppm/℃ Operating Temperature Range:-55℃~+155℃ Operating Temperature Range:-55℃~+155℃; LCSC Part Name: 0Ω ±1% 125mW 厚膜电阻; Supplier Part: C17477; Manufacturer: UNI-ROYAL(厚声); Manufacturer Part: 0805W8F0000T5E; Supplier Footprint: 0805; JLCPCB Part Class: Basic Part; Datasheet: https://atta.szlcsc.com/upload/public/pdf/source/20200306/C422600_1E6D84923E4A46A82E41ADD87F860B5C.pdf; Supplier: LCSC; Type: Thick Film Resistors; Tolerance: ±1%; Temperature Coefficient: ±800ppm/℃; Operating Temperature Range: -55℃~+155℃
RADIO = SI4705-D60-GM: Supplier Part: C1526114; Manufacturer: SKYWORKS/SILICON LABS(芯科); Supplier Footprint: QFN-20-EP(3x3); JLCPCB Part Class: Extended Part; Datasheet: https://atta.szlcsc.com/upload/public/pdf/source/20210603/097935DFE49676B16CAB25B24893A3FB.pdf; Supplier: LCSC
RUMBLER SPEAKER USBSEL V3_EN = HDR-M_2.54_1x2P: Supplier Footprint: Through
X1 X2 = Q13FC13500004_C32346: Crystal Type:Surface Mount Crystal Frequency: Normal temperature Frequency Tolerance:±20ppm Normal temperature Frequency Tolerance:±20ppm Load Capacitor: Equivalent Series Resistance (ESR):70kΩ Operating Temperature: Operating Temperature:; LCSC Part Name: 32.768kHz ±20ppm 12.5pF; Supplier Part: C32346; Manufacturer: EPSON(爱普生); Manufacturer Part: Q13FC13500004; Supplier Footprint: SMD3215-2P; JLCPCB Part Class: Basic Part; Datasheet: https://atta.szlcsc.com/upload/public/pdf/source/20240418/0E0FF5F0356BA3753F616001439D1416.pdf; Supplier: LCSC; Crystal Type: Surface Mount Crystal; Normal temperature Frequency Tolerance: ±20ppm; Equivalent Series Resistance (ESR): 70kΩ
AVR = ATTINY3217-MFR: Supplier Part: C617969; Manufacturer: MICROCHIP(美国微芯); Supplier Footprint: WQFN-24-EP(4x4); JLCPCB Part Class: Extended Part; Datasheet: https://atta.szlcsc.com/upload/public/pdf/source/20221017/C07D66C14B922F573E9000C75FCA8F84.pdf; Supplier: LCSC
D4-D12 D14 D15 D17 = 1N5819WS_C191023: Reverse Voltage (Vr):40V Average Rectified Current (Io):1A Forward Voltage (Vf@If):600mV@1A; LCSC Part Name: 40V1A600mV@1A; Supplier Part: C191023; Manufacturer: Hottech(合科泰); Supplier Footprint: SOD-323; JLCPCB Part Class: BasicPart; Datasheet: https://atta.szlcsc.com/upload/public/pdf/source/20220428/3CB86FD8D28D653594B4E35F9D5AEFD9.pdf; Supplier: LCSC; Reverse Voltage (Vr): 40V; Average Rectified Current (Io): 1A; Forward Voltage (Vf@If): 600mV@1A
Q6 Q9 = AO3400A_C20917: Type: Drain Source Voltage (Vdss): Continuous Drain Current (Id): Power Dissipation (Pd): Drain Source On Resistance (RDS(on)@Vgs,Id):26.5mΩ@10V,5.7A Gate Threshold Voltage (Vgs(th)@Id):1.5V@250uA; LCSC Part Name: N沟道30V5.7A; Supplier Part: C20917; Manufacturer: AOS; Supplier Footprint: SOT-23-3L; JLCPCB Part Class: BasicPart; Datasheet: https://atta.szlcsc.com/upload/public/pdf/source/20140107/1457706668533.pdf; Supplier: LCSC; Drain Source On Resistance (RDS(on)@Vgs,Id): 26.5mΩ@10V,5.7A; Gate Threshold Voltage (Vgs(th)@Id): 1.5V@250uA
R48 R54 R55 R76 R110-R113 R119 R120 = 0402WGF1002TCE: Type:Thick Film Resistors Resistance: Tolerance:±1% Tolerance:±1% Power(Watts): Temperature Coefficient:±100ppm/℃ Temperature Coefficient:±100ppm/℃ Overload Voltage (Max): Operating Temperature Range:-55℃~+155℃ Operating Temperature Range:-55℃~+155℃; LCSC Part Name: 10kΩ±1%62.5mW; Supplier Part: C25744; Manufacturer: UNI-ROYAL(厚声); Supplier Footprint: 0402; JLCPCB Part Class: BasicPart; Datasheet: https://atta.szlcsc.com/upload/public/pdf/source/20200306/C422600_1E6D84923E4A46A82E41ADD87F860B5C.pdf; Supplier: LCSC; Type: ThickFilmResistors; Tolerance: ±1%; Temperature Coefficient: ±100ppm/℃; Operating Temperature Range: -55℃~+155℃
R84 = 0805W8F510KT5E: Type:Thick Film Resistors Resistance:5.1Ω Tolerance:±1% Tolerance:±1% Power(Watts): Overload Voltage (Max): Temperature Coefficient:±400ppm/℃ Temperature Coefficient:±400ppm/℃ Operating Temperature Range:-55℃~+155℃ Operating Temperature Range:-55℃~+155℃; LCSC Part Name: 5.1Ω ±1% 125mW 厚膜电阻; Supplier Part: C17724; Manufacturer: UNI-ROYAL(厚声); Supplier Footprint: 0805; JLCPCB Part Class: Basic Part; Datasheet: https://atta.szlcsc.com/upload/public/pdf/source/20200306/C422600_1E6D84923E4A46A82E41ADD87F860B5C.pdf; Supplier: LCSC; Type: Thick Film Resistors; Tolerance: ±1%; Temperature Coefficient: ±400ppm/℃; Operating Temperature Range: -55℃~+155℃
R87 = 0402WGF4700TCE: Type:Thick Film Resistors Resistance: Tolerance:±1% Tolerance:±1% Power(Watts): Temperature Coefficient:±100ppm/℃ Temperature Coefficient:±100ppm/℃ Overload Voltage (Max): Operating Temperature Range:-55℃~+155℃ Operating Temperature Range:-55℃~+155℃; LCSC Part Name: 470Ω±1%62.5mW; Supplier Part: C25117; Manufacturer: UNI-ROYAL(厚声); Supplier Footprint: 0402; JLCPCB Part Class: BasicPart; Datasheet: https://atta.szlcsc.com/upload/public/pdf/source/20200306/C422600_1E6D84923E4A46A82E41ADD87F860B5C.pdf; Supplier: LCSC; Type: ThickFilmResistors; Tolerance: ±1%; Temperature Coefficient: ±100ppm/℃; Operating Temperature Range: -55℃~+155℃
R91 R92 = 0402WGF1001TCE: Type:Thick Film Resistors Resistance: Tolerance:±1% Tolerance:±1% Power(Watts): Temperature Coefficient:±100ppm/℃ Temperature Coefficient:±100ppm/℃ Overload Voltage (Max): Operating Temperature Range:-55℃~+155℃ Operating Temperature Range:-55℃~+155℃; LCSC Part Name: 1kΩ±1%62.5mW; Supplier Part: C11702; Manufacturer: UNI-ROYAL(厚声); Supplier Footprint: 0402; JLCPCB Part Class: BasicPart; Datasheet: https://atta.szlcsc.com/upload/public/pdf/source/20200306/C422600_1E6D84923E4A46A82E41ADD87F860B5C.pdf; Supplier: LCSC; Type: ThickFilmResistors; Tolerance: ±1%; Temperature Coefficient: ±100ppm/℃; Operating Temperature Range: -55℃~+155℃
AVCC GND GND1 GND2 RGB = HDR-M_2.54_1x3P: Supplier Footprint: Through
SW1-SW11 = TS-1187A-B-A-B: Circuit:SPST Actuator Style:Round Button Operating Force:160gf Mounting Style:Brick nogging Switch Length:5.1mm Switch Width:5.1mm Switch Height:1.5mm Strike Gundam:不带 Contact Current:50mA Voltage Rating (DC):12V Insulation Resistance:- Actuator/Cap Color; LCSC Part Name: 5.1*5.1*1.5mm 立贴 轻触开关; Supplier Part: C318884; Manufacturer: XKB Connectivity(中国星坤); Supplier Footprint: SMD; JLCPCB Part Class: Basic Part; Datasheet: https://atta.szlcsc.com/upload/public/pdf/source/20200227/C318890_053E50208A88A7BA1965D8746000774E.pdf; Supplier: LCSC; Contact Current: 50mA; Voltage Rating (DC): 12V; Circuit: SPST; Mounting Style: Brick nogging; Actuator Style: Round Button; Actuator/Cap Color: 金色; With Lamp: No; Operating Force: 160gf; Mechanical Life: 10万次; Operating Temperature: -30℃~+85℃; Switch Length: 5.1mm; Switch Width: 5.1mm; Switch Height: 1.5mm; Strike Gundam: 不带
U33 = SN74LVC1T45DBVR: Channel Type:Bi-Directional Data Rate:420Mbps Supply Voltage (VCCA):1.65V~5.5V Supply Voltage (VCCA):1.65V~5.5V Supply Voltage (VCCB):1.65V~5.5V Supply Voltage (VCCB):1.65V~5.5V Number of Circuits:1 Channels per Circuit:1 Output Type:非反相；Tri-State Operati; Supplier Part: C7843; Manufacturer: TI(德州仪器); Supplier Footprint: SOT-23-6; JLCPCB Part Class: Extended Part; Datasheet: https://www.ti.com/cn/lit/gpn/sn74lvc1t45; Supplier: LCSC; Channel Type: Bi-Directional; Data Rate: 420Mbps; Supply Voltage (VCCA): 1.65V~5.5V; Supply Voltage (VCCB): 1.65V~5.5V; Number of Circuits: 1; Channels per Circuit: 1; Output Type: 非反相；Tri-State; Operating Temperature: -40℃~+85℃
C132 C215 C216 C228 C229 = CL10A226MQ8NRNC: Capacitance: Tolerance:±20% Tolerance:±20% Voltage Rated: Temperature Coefficient:; LCSC Part Name: 22uF±20%6.3V; Supplier Part: C59461; Manufacturer: SAMSUNG(三星); Supplier Footprint: 0603; JLCPCB Part Class: BasicPart; Datasheet: https://atta.szlcsc.com/upload/public/pdf/source/20160103/1457707740762.pdf; Supplier: LCSC; Tolerance: ±20%
L15 = IP4252CZ16-8-TTL,1: Supplier Part: C458218; Manufacturer: Nexperia(安世); Supplier Footprint: UDFN-16-EP(1.4x3.3); JLCPCB Part Class: Extended Part; Datasheet: https://atta.szlcsc.com/upload/public/pdf/source/20191127/C461172_525550BE1F83C1B61EE5D9157686BE2E.pdf; Supplier: LCSC
microSD = TF-01A_C91145: Card Connection Mode:Self-bouncing Card Type:MicroSD card (TF card) Connector Type:Card Slot Additional Card Detection Pins:- Supplementary Features:With Locating Pin Maximum Body Height:1.85mm Operating Temperature Range:- Operating Temperature Range:-; LCSC Part Name: 自弹式 MicroSD卡(TF卡) 卡座; Supplier Part: C91145; Manufacturer: 韩国韩荣; Supplier Footprint: SMD; JLCPCB Part Class: Extended Part; Datasheet: https://atta.szlcsc.com/upload/public/pdf/source/20190322/C91145_63CBD6FB4639A3A3EC6A9721F18AE0FB.pdf; Supplier: LCSC; Card Connection Mode: Self-bouncing; Card Type: MicroSD card (TF card); Connector Type: Card Slot; Supplementary Features: With Locating Pin; Maximum Body Height: 1.85mm
R45 R46 = 0805W8F2201T5E_C17520: Type:Thick Film Resistors Resistance:2.2kΩ Tolerance:±1% Tolerance:±1% Power(Watts): Overload Voltage (Max): Temperature Coefficient:±100ppm/℃ Temperature Coefficient:±100ppm/℃ Operating Temperature Range:-55℃~+155℃ Operating Temperature Range:-55℃~+155℃; LCSC Part Name: 2.2kΩ ±1% 125mW 厚膜电阻; Supplier Part: C17520; Manufacturer: UNI-ROYAL(厚声); Manufacturer Part: 0805W8F2201T5E; Supplier Footprint: 0805; JLCPCB Part Class: Basic Part; Datasheet: https://atta.szlcsc.com/upload/public/pdf/source/20200306/C422600_1E6D84923E4A46A82E41ADD87F860B5C.pdf; Supplier: LCSC; Type: Thick Film Resistors; Tolerance: ±1%; Temperature Coefficient: ±100ppm/℃; Operating Temperature Range: -55℃~+155℃
U40 = TS5A23159RSER: Switch Circuit:SPDT(SPDT) Number of Channels:2 Supply Voltage:1.65V~5.5V Supply Voltage:1.65V~5.5V Turn-on time:28ns On-State Resistance (Max):1.7Ω Turn-off time:9ns Operating Temperature:-40℃~+85℃ Operating Temperature:-40℃~+85℃; LCSC Part Name: TS5A23159 1-Q 2-通道 SPDT 模拟开关; Supplier Part: C138710; Manufacturer: TI(德州仪器); Supplier Footprint: UQFN-10-EP(1.5x2); JLCPCB Part Class: Extended Part; Datasheet: https://www.ti.com/cn/lit/gpn/ts5a23159; Supplier: LCSC; Switch Circuit: SPDT(SPDT); Number of Channels: 2; Supply Voltage: 1.65V~5.5V; Turn-on time: 28ns; On-State Resistance (Max): 1.7Ω; Turn-off time: 9ns; Operating Temperature: -40℃~+85℃
3V3 VDD = TPS62825DMQT: Function:Step-down type Output Type:Adjustable Input Voltage:2.4V~5.5V Input Voltage:2.4V~5.5V Output Voltage:600mV~4V Output Voltage:600mV~4V Output Current (Max):2A Switching Frequency:2.2MHz Operating Temperature:-40℃~+125℃@(TJ) Operating Temperature:-; Supplier Part: C3189970; Manufacturer: TI(德州仪器); Supplier Footprint: VSON-6(1.5x1.5); JLCPCB Part Class: Extended Part; Datasheet: https://www.ti.com/cn/lit/gpn/tps62826; Supplier: LCSC; Function: Step-down type; Output Type: Adjustable; Input Voltage: 2.4V~5.5V; Output Voltage: 600mV~4V; Output Current (Max): 2A; Switching Frequency: 2.2MHz; Operating Temperature: -40℃~+125℃@(TJ); Synchronous Rectification: Yes; Number of Outputs: 1; Topology: Step-down; Switch tube (built-in/external): 内置
5V = HX4002-MFC: Function:Charge pump Synchronous Rectification:NO Number of Outputs:1 Topology:- Input Voltage:2.7V~5.5V Input Voltage:2.7V~5.5V Output Voltage:5V Output Voltage:5V Output Current (Max):250mA Switching Frequency:1.2MHz; LCSC Part Name: 电荷泵Vin=2.7V~5.5VVout=5V250mA; Supplier Part: C172354; Manufacturer: HEXIN(禾芯微); Supplier Footprint: SOT-23-6; JLCPCB Part Class: ExtendedPart; Datasheet: https://atta.szlcsc.com/upload/public/pdf/source/20180202/C172354_15175649156801336361.pdf; Supplier: LCSC; Function: Chargepump; Synchronous Rectification: NO; Number of Outputs: 1; Input Voltage: 2.7V~5.5V; Output Current (Max): 250mA; Switching Frequency: 1.2MHz
BATT = HDR-M_2.54_1x4P: Supplier Footprint: Through
C81 C82 = CL10A106MA8NRNC: Capacitance: Tolerance:±20% Tolerance:±20% Voltage Rated: Temperature Coefficient:; LCSC Part Name: 10uF±20%25V; Supplier Part: C96446; Manufacturer: SAMSUNG(三星); Supplier Footprint: 0603; JLCPCB Part Class: BasicPart; Datasheet: https://atta.szlcsc.com/upload/public/pdf/source/20170325/1490427913016.pdf; Supplier: LCSC; Tolerance: ±20%
C83 = CL10A225KO8NNNC: Capacitance: Tolerance:±10% Tolerance:±10% Voltage Rated: Temperature Coefficient:; LCSC Part Name: 2.2uF±10%16V; Supplier Part: C23630; Manufacturer: SAMSUNG(三星); Supplier Footprint: 0603; JLCPCB Part Class: BasicPart; Datasheet: https://atta.szlcsc.com/upload/public/pdf/source/20160103/1457707709512.pdf; Supplier: LCSC; Tolerance: ±10%
C214 C224 C225 = CL05A475MP5NRNC: Capacitance: Tolerance:±20% Tolerance:±20% Voltage Rated: Temperature Coefficient:; LCSC Part Name: 4.7uF±20%10V; Supplier Part: C23733; Manufacturer: SAMSUNG(三星); Supplier Footprint: 0402; JLCPCB Part Class: BasicPart; Datasheet: https://atta.szlcsc.com/upload/public/pdf/source/20160103/1457707710457.pdf; Supplier: LCSC; Tolerance: ±20%
C219-C221 = CL10A106KP8NNNC: Capacitance: Tolerance:±10% Tolerance:±10% Voltage Rated: Temperature Coefficient:; LCSC Part Name: 10uF ±10% 10V; Supplier Part: C19702; Manufacturer: SAMSUNG(三星); Supplier Footprint: 0603; JLCPCB Part Class: Basic Part; Datasheet: https://atta.szlcsc.com/upload/public/pdf/source/20160218/1457707763339.pdf; Supplier: LCSC; Tolerance: ±10%
C230 C231 = CC0402JRNPO9BN121: Capacitance: Tolerance:±5% Tolerance:±5% Voltage Rated: Temperature Coefficient:; LCSC Part Name: 120pF ±5% 50V; Supplier Part: C106996; Manufacturer: YAGEO(国巨); Supplier Footprint: 0402; JLCPCB Part Class: Extended Part; Datasheet: https://atta.szlcsc.com/upload/public/pdf/source/20170914/C128857_1505359892143968080.pdf; Supplier: LCSC; Tolerance: ±5%
C243 = CL10B473KB8NNNC: Capacitance: Tolerance:±10% Tolerance:±10% Voltage Rated: Temperature Coefficient:; LCSC Part Name: 47nF±10%50V; Supplier Part: C1622; Manufacturer: SAMSUNG(三星); Supplier Footprint: 0603; JLCPCB Part Class: BasicPart; Datasheet: https://atta.szlcsc.com/upload/public/pdf/source/20160103/1457707684971.pdf; Supplier: LCSC; Tolerance: ±10%
C245 C246 = CL21B105KBFNNNE: Capacitance: Tolerance:±10% Tolerance:±10% Voltage Rated: Temperature Coefficient:; LCSC Part Name: 1uF ±10% 50V; Supplier Part: C28323; Manufacturer: SAMSUNG(三星); Supplier Footprint: 0805; JLCPCB Part Class: Basic Part; Datasheet: https://atta.szlcsc.com/upload/public/pdf/source/20160218/1457707763339.pdf; Supplier: LCSC; Tolerance: ±10%
ILIM = 0805W8F2700T5E: Type:Thick Film Resistors Resistance: Tolerance:±1% Tolerance:±1% Power(Watts): Overload Voltage (Max): Temperature Coefficient:±100ppm/℃ Temperature Coefficient:±100ppm/℃ Operating Temperature Range:-55℃~+155℃ Operating Temperature Range:-55℃~+155℃; LCSC Part Name: 270Ω ±1% 125mW 厚膜电阻; Supplier Part: C17590; Manufacturer: UNI-ROYAL(厚声); Supplier Footprint: 0805; JLCPCB Part Class: Extended Part; Datasheet: https://atta.szlcsc.com/upload/public/pdf/source/20200306/C422600_1E6D84923E4A46A82E41ADD87F860B5C.pdf; Supplier: LCSC; Type: Thick Film Resistors; Tolerance: ±1%; Temperature Coefficient: ±100ppm/℃; Operating Temperature Range: -55℃~+155℃
L17 = IHLP1212BZER2R2M11: Inductance: Tolerance:±20% Tolerance:±20% Rated Current: Saturation Current (Isat):3.3A DC Resistance (DCR): Type:- Ratings:-; LCSC Part Name: 2.2uH ±20% 3.3A; Supplier Part: C553996; Manufacturer: VISHAY(威世); Supplier Footprint: SMD; JLCPCB Part Class: Extended Part; Datasheet: https://atta.szlcsc.com/upload/public/pdf/source/20210201/C553996_2AB0AFEEFF1E1AB22554D6AE694AD6DF.pdf; Supplier: LCSC; Tolerance: ±20%; Saturation Current (Isat): 3.3A
PWR = BQ25895RTWR: Supplier Part: C80200; Manufacturer: TI(德州仪器); Supplier Footprint: QFN-24(4x4); JLCPCB Part Class: ExtendedPart; Datasheet: https://atta.szlcsc.com/upload/public/pdf/source/20171123/C80200_15114362377651139443.pdf; Supplier: LCSC
R115 R116 = 0402WGF1003TCE: Type:Thick Film Resistors Resistance: Tolerance:±1% Tolerance:±1% Power(Watts): Temperature Coefficient:±100ppm/℃ Temperature Coefficient:±100ppm/℃ Overload Voltage (Max): Operating Temperature Range:-55℃~+155℃ Operating Temperature Range:-55℃~+155℃; LCSC Part Name: 100kΩ±1%62.5mW; Supplier Part: C25741; Manufacturer: UNI-ROYAL(厚声); Supplier Footprint: 0402; JLCPCB Part Class: BasicPart; Datasheet: https://atta.szlcsc.com/upload/public/pdf/source/20200306/C422600_1E6D84923E4A46A82E41ADD87F860B5C.pdf; Supplier: LCSC; Type: ThickFilmResistors; Tolerance: ±1%; Temperature Coefficient: ±100ppm/℃; Operating Temperature Range: -55℃~+155℃
R117 R118 = FRC0402F4503TS: Type:Thick Film Resistors Resistance:450kΩ Tolerance:±1% Tolerance:±1% Power(Watts): Overload Voltage (Max): Temperature Coefficient:±100ppm/℃ Temperature Coefficient:±100ppm/℃; LCSC Part Name: 450kΩ ±1% 62.5mW 厚膜电阻; Supplier Part: C5159688; Manufacturer: FOJAN(富捷); Supplier Footprint: 0402; JLCPCB Part Class: Extended Part; Datasheet: https://atta.szlcsc.com/upload/public/pdf/source/20211221/925EC7D7225764EE0046F22065062C87.pdf; Supplier: LCSC; Type: Thick Film Resistors; Tolerance: ±1%; Temperature Coefficient: ±100ppm/℃
U42 = TPS7A2030PDBVR: Output Type:-; Supplier Part: C963429; Manufacturer: TI(德州仪器); Supplier Footprint: SOT-23-5; JLCPCB Part Class: ExtendedPart; Datasheet: https://atta.szlcsc.com/upload/public/pdf/source/20230221/9B73099824E408F4B24BD95C528A27ED.pdf; Supplier: LCSC
USB1 USB2 = TFM201610ALC-R47MTAA: Inductance: Tolerance:±20% Tolerance:±20% Rated Current:- Saturation Current (Isat):5.1A DC Resistance (DCR): Q @ Freq:- Frequency - Self Resonant:- Ratings:; LCSC Part Name: 470nH ±20% 5.1A; Supplier Part: C2045043; Manufacturer: TDK; Supplier Footprint: 0806; JLCPCB Part Class: Extended Part; Datasheet: https://atta.szlcsc.com/upload/public/pdf/source/20210603/B6909FD921DE33B245D498B0D096D011.pdf; Supplier: LCSC; Tolerance: ±20%; Saturation Current (Isat): 5.1A

## Nets
3V3: 3V1.1 AVR.4(VDD) C118.2 C228.2 C230.2 C234.2 R45.2 R46.2 R117.2 R128.2 R129.2 R130.2 U33.1(VCCA) U33.5(DIR) U40.8(VCC) USB1.2 ; also on sheet 5
5V: 5V.1(VOUT) C82.2 RGB.3 U33.6(VCCB)
5V_ON: 5V.3(EN) 5V_EN.1 AVR.21(PC4) R48.1
GND: 3V3.4(GND) 5V.2(GND) AMP.7(GND) AMP.9(EP) AUDIO.7(IOVSS) AUDIO.12(SPI_SELECT) AUDIO.17(AVSS) AUDIO.28(DVSS) AUDIO.33(EP) AVR.3(GND) AVR.25(GND) BATT.1 BATT.2 C81.1 C82.1 C118.1 C132.1 C191.1 C192.1 C201.2 C202.2 C203.2 C204.2 C208.1 C209.1 C214.1 C215.1 C216.1 C218.1 C219.1 C220.1 C221.1 C224.1 C225.1 C228.1 C229.1 C232.1 C233.1 C234.1 C236.1 C237.2 C238.2 C239.1 C244.1 C245.1 C246.1 DE-POP.1 DE-POP1.1 GND.1 GND.2 GND.3 GND1.1 GND1.2 GND1.3 GND2.1 GND2.2 GND2.3 ILIM.2 L15.17(EP) L18.2 L19.2 microSD.6(VSS) microSD.10(GND) microSD.11(GND) microSD.12(GND) microSD.13(GND) PWR.17(PGND) PWR.18(PGND) PWR.25(PAD) Q6.2(S) Q9.2(S) R48.2 R54.2 R55.2 R104.1 R110.2 R111.2 R113.2 R115.1 R116.1 R119.2 R120.2 R121.2 R122.2 R130.1 RADIO.3(RFGND) RADIO.6(SEN#) RADIO.12(GND) RADIO.21(EP) RGB.1 U33.2(GND) U40.3(GND) U42.2(GND) VDD.4(GND) ; also on sheet 5 6 7
V3_LDO: C246.2 U42.5(OUT) V3_EN.1
VBATT: BATT.3 BATT.4 C221.2 PWR.13(BAT) PWR.14(BAT)
VCC: 3V3.1(EN) 3V3.6(VIN) 5V.5(VIN) C81.2 C219.2 C220.2 C224.2 C225.2 L17.2 PWR.15(SYS) PWR.16(SYS) VDD.6(VIN)
VDD_EN: AVR.5(PA4) U40.1(IN1) U40.5(IN2) VDD.1(EN) VDD_EN.1
ACCEL_INT: AVR.22(PC5) R129.1 ; also on sheet 5
AUDIO_INT: AUDIO.11(MISO/MFP4) ; also on sheet 7
AUDIO_MICBIAS: AUDIO.19(MICBIAS) R103.2 R123.2
AUDIO_RESET: ARESET.1 AUDIO.31(RESET#)
AVR_INT: AVR.20(PC3) AVR_INT.1 ; also on sheet 7
AVR_TX: AVR.24(PA1) ; also on sheet 6
BTN_1: AVR.12(PB4) D5.2(A) D9.2(A) D17.2(A)
BTN_2: AVR.9(PB7) D6.2(A) D10.2(A) D14.2(A)
BTN_3: AVR.10(PB6) D7.2(A) D11.2(A) D15.2(A)
BTN_4: AVR.6(PA5) D8.2(A) D12.2(A)
BTN_ABXY: AVR.8(PA7) SW2.3(C) SW2.4(D) SW5.3(C) SW5.4(D) SW8.3(C) SW8.4(D) SW11.3(C) SW11.4(D)
BTN_CTRL: AVR.11(PB5) SW3.3(C) SW3.4(D) SW6.3(C) SW6.4(D) SW9.3(C) SW9.4(D)
BTN_DPAD: AVR.19(PC2) SW1.3(C) SW1.4(D) SW4.3(C) SW4.4(D) SW7.3(C) SW7.4(D) SW10.3(C) SW10.4(D)
DISP_LED_K: R84.1 ; also on sheet 6
EMBEDDED_ANTENNA: FMA.1 L19.1 RADIO.4(LPI)
HEADSET_ANTENNA: C242.2 RADIO.2(FMI)
HEADSET_DETECT: AUDIO.8(SCLK/MFP3) C207.2 HEADSET.2 R123.1
HEADSET_LEFT: AUDIO.25(HPL) C199.2
HEADSET_MIC: AUDIO.21(IN3_R) C207.1
HEADSET_RIGHT: AUDIO.27(HPR) C200.2
I2C_SCL: AVR.16(PB0) PWR.5(SCL) R45.1 U40.2(NO1) ; also on sheet 5 6
I2C_SCL_VDD: AUDIO.9(SCL/SS#) RADIO.7(SCLK) SCL_VDD.1 U40.10(COM1) ; also on sheet 7
I2C_SDA: AVR.15(PB1) PWR.6(SDA) R46.1 U40.4(NO2) ; also on sheet 5 6
I2C_SDA_VDD: AUDIO.10(SDA/MOSI) RADIO.8(SDIO) SDA_VDD.1 U40.6(COM2) ; also on sheet 7
I2S_BCK: AUDIO.2(BCLK) ; also on sheet 6 7
I2S_DIN: AUDIO.4(DIN/MFP1) ; also on sheet 6 7
I2S_DOUT: AUDIO.5(DOUT/MFP2) ; also on sheet 6 7
I2S_LRCK: AUDIO.3(WCLK) ; also on sheet 6 7
IOVDD: AMP.6(VDD) AUDIO.6(IOVDD) AUDIO.26(LDOIN/HPVDD) AUDIO.30(LDO_SELECT) AVCC.2 AVCC.3 C132.2 C191.2 C192.2 C204.1 C208.2 C209.2 C229.2 C231.2 C236.2 C237.1 C245.2 D4.1(K) IOVDD.1 microSD.4(VDD) R76.1 R118.2 R131.2 RADIO.10(VD) RADIO.11(VA) RUMBLER.2 U42.1(IN) U42.3(EN) USB2.2 ; also on sheet 6 7
MIC_N: AUDIO.13(IN1_L) C206.1
MIC_P: AUDIO.14(IN1_R) C205.1
PWM_BACKLIGHT: AVR.17(PC0) R92.2
PWM_RUMBLER: AVR.2(EXTCLK/PA3) R91.2
PWR_INT: AVR.1(PA2) PWR.7(INT) PWR_INT.1 R128.1
QSPI_SS: AVR.18(PC1) ; also on sheet 6 7
RADIO_INT: R131.1 RADIO.18(GPO2/[INT#]) RADIO_INT.1 ; also on sheet 7
RADIO_L: AUDIO.15(IN2_L) C240.2 RIN_L.1
RADIO_R: AUDIO.16(IN2_R) C241.2 RIN_R.1
RADIO_RESET: RADIO.5(RST#) ; also on sheet 7
RGB: AVR.7(PA6) U33.3(A)
SD_CSN: L15.2(IN2) ; also on sheet 7
SD_RX: L15.3(IN3) ; also on sheet 7
SD_SCK: L15.5(IN5) ; also on sheet 7
SD_TX: L15.4(IN4) ; also on sheet 7
SDIO_1: L15.6(IN6) ; also on sheet 7
SDIO_2: L15.7(IN7) ; also on sheet 7
SPEAKER_EN: AMP.1(#SHUTDOWN) AUDIO.32(GPIO/MFP5) SPKR_EN.1
SPEAKER_N: AUDIO.22(LOL) R105.1
SPEAKER_P: AUDIO.23(LOR) R106.1
UPDI: AVR.23(PA0/RESET#/UPDI) ; also on sheet 6
VUSB: C218.2 PWR.1(VBUS) VUSB.1 ; also on sheet 6
$1N1000: 5V.4(C-) C83.1
$1N1001: 5V.6(C+) C83.2
$1N63464: C214.2 PWR.22(REGN) R112.1
$1N63472: C243.2 L17.1 PWR.19(SW) PWR.20(SW)
$1N63621: CE.1 PWR.9(CE) R110.1
$1N63731: C215.2 C216.2 PMID.1 PWR.23(PMID)
$1N64929: C243.1 PWR.21(BTST)
$1N65109: OTG.1 PWR.8(OTG) R111.1
$1N65541: PWR.11(TS) R112.2 R113.1
$1N65681: ILIM.1 PWR.10(ILIM)
$1N67269: 3V3.5(SW) USB1.1
$1N67295: 3V3.3(FB) C230.1 R115.2 R117.1
$1N67403: C231.1 R116.2 R118.1 VDD.3(FB)
$1N67445: USB2.1 VDD.5(SW)
$1N75550: PWR.12(QON) QON.1
$1N90433: DSEL.1 PWR.24(DSEL)
$1N99625: AVCC.1 V3_EN.2
$1N101904: PWR.2(D+) USBSEL.2
$1N101910: PWR.3(D–) USBSEL.1
$2N19576: L15.14(OUT3) microSD.7(DAT0(D0)) R76.2
$2N25545: L15.10(OUT7) microSD.1(DAT2(RSV))
$2N25554: L15.15(OUT2) microSD.2(CDDAT3(CS))
$2N25581: L15.13(OUT4) microSD.3(CMD(DI))
$2N25588: L15.12(OUT5) microSD.5(CLK(SCLK))
$2N25598: L15.11(OUT6) microSD.8(DAT1(RSV))
$2N27404: R120.1 U40.7(NC2)
$2N27409: R119.1 U40.9(NC1)
$2N38338: microSD.9(CD) SD_CD.1
$3N64809: AUDIO.18(REF) C201.1
$3N64814: AUDIO.24(AVDD) C202.1
$3N64820: AUDIO.29(DVDD) C203.1
$3N65040: AUDIO.1(MCLK) MCLK.1
$3N65354: C205.2 MIC.1(+) R103.1
$3N65358: C206.2 MIC.2(-) R104.2
$3N65820: AMP.4(IN-) R105.2
$3N66044: C200.1 DE-POP.2 HEADSET.3
$3N66054: C199.1 DE-POP1.2 HEADSET.4
$3N66059: C242.1 HEADSET.1 L18.1
$3N66555: AMP.3(IN+) R106.2
$3N66592: AMP.8(VO-) SPEAKER.1
$3N66597: AMP.5(VO+) SPEAKER.2
$3N73775: C238.1 RADIO.9(RCLK) X2.1
$3N73781: C239.2 RADIO.17(GPO3/[DCLK]) X2.2
$3N73999: C241.1 R121.1 R133.2
$3N74004: C240.1 R122.1 R132.2
$3N78093: RADIO.19(GPO1) RADIO_GPO1.1
$3N79210: AUDIO.20(IN3_L) C244.2
$3N93524: R132.1 RADIO.14(LOUT/[DFS]) ROUT_L.1
$3N93531: R133.1 RADIO.13(ROUT/[DOUT]) ROUT_R.1
$4N10766: D8.1(K) SW10.1(A) SW10.2(B)
$4N10774: D7.1(K) SW7.1(A) SW7.2(B)
$4N10782: D6.1(K) SW4.1(A) SW4.2(B)
$4N10794: D5.1(K) SW1.1(A) SW1.2(B)
$4N10842: D15.1(K) SW9.1(A) SW9.2(B)
$4N10903: D9.1(K) SW2.1(A) SW2.2(B)
$4N10915: D10.1(K) SW5.1(A) SW5.2(B)
$4N17155: D14.1(K) SW6.1(A) SW6.2(B)
$4N18597: D12.1(K) SW11.1(A) SW11.2(B)
$4N18613: D11.1(K) SW8.1(A) SW8.2(B)
$4N38253: Q6.3(D) R84.2
$4N50022: R87.1 U33.4(B)
$4N50025: R87.2 RGB.2
$4N56569: D4.2(A) Q9.3(D) RUMBLER.1
$4N56605: Q9.1(G) R54.1 R91.1
$4N56656: Q6.1(G) R55.1 R92.1
$4N78796: D17.1(K) SW3.1(A) SW3.2(B)
$4N81859: AVR.13(PB3/TOSC1) C232.2 X1.1
$4N81864: AVR.14(PB2/TOSC2) C233.2 X1.2

Not connected (* = marked no-connect by the designer): 3V3 2(PG); AMP 2(NC); HEADSET 5 6; L15 1(IN1) 8(IN8) 9(OUT8) 16(OUT1); PWR 4(STAT); RADIO 1(NC) 15(DOUT) 16(DFS) 20(NC); U42 4(N/C); VDD 2(PG)
